# Altium project mat'_v4.PrjPcb
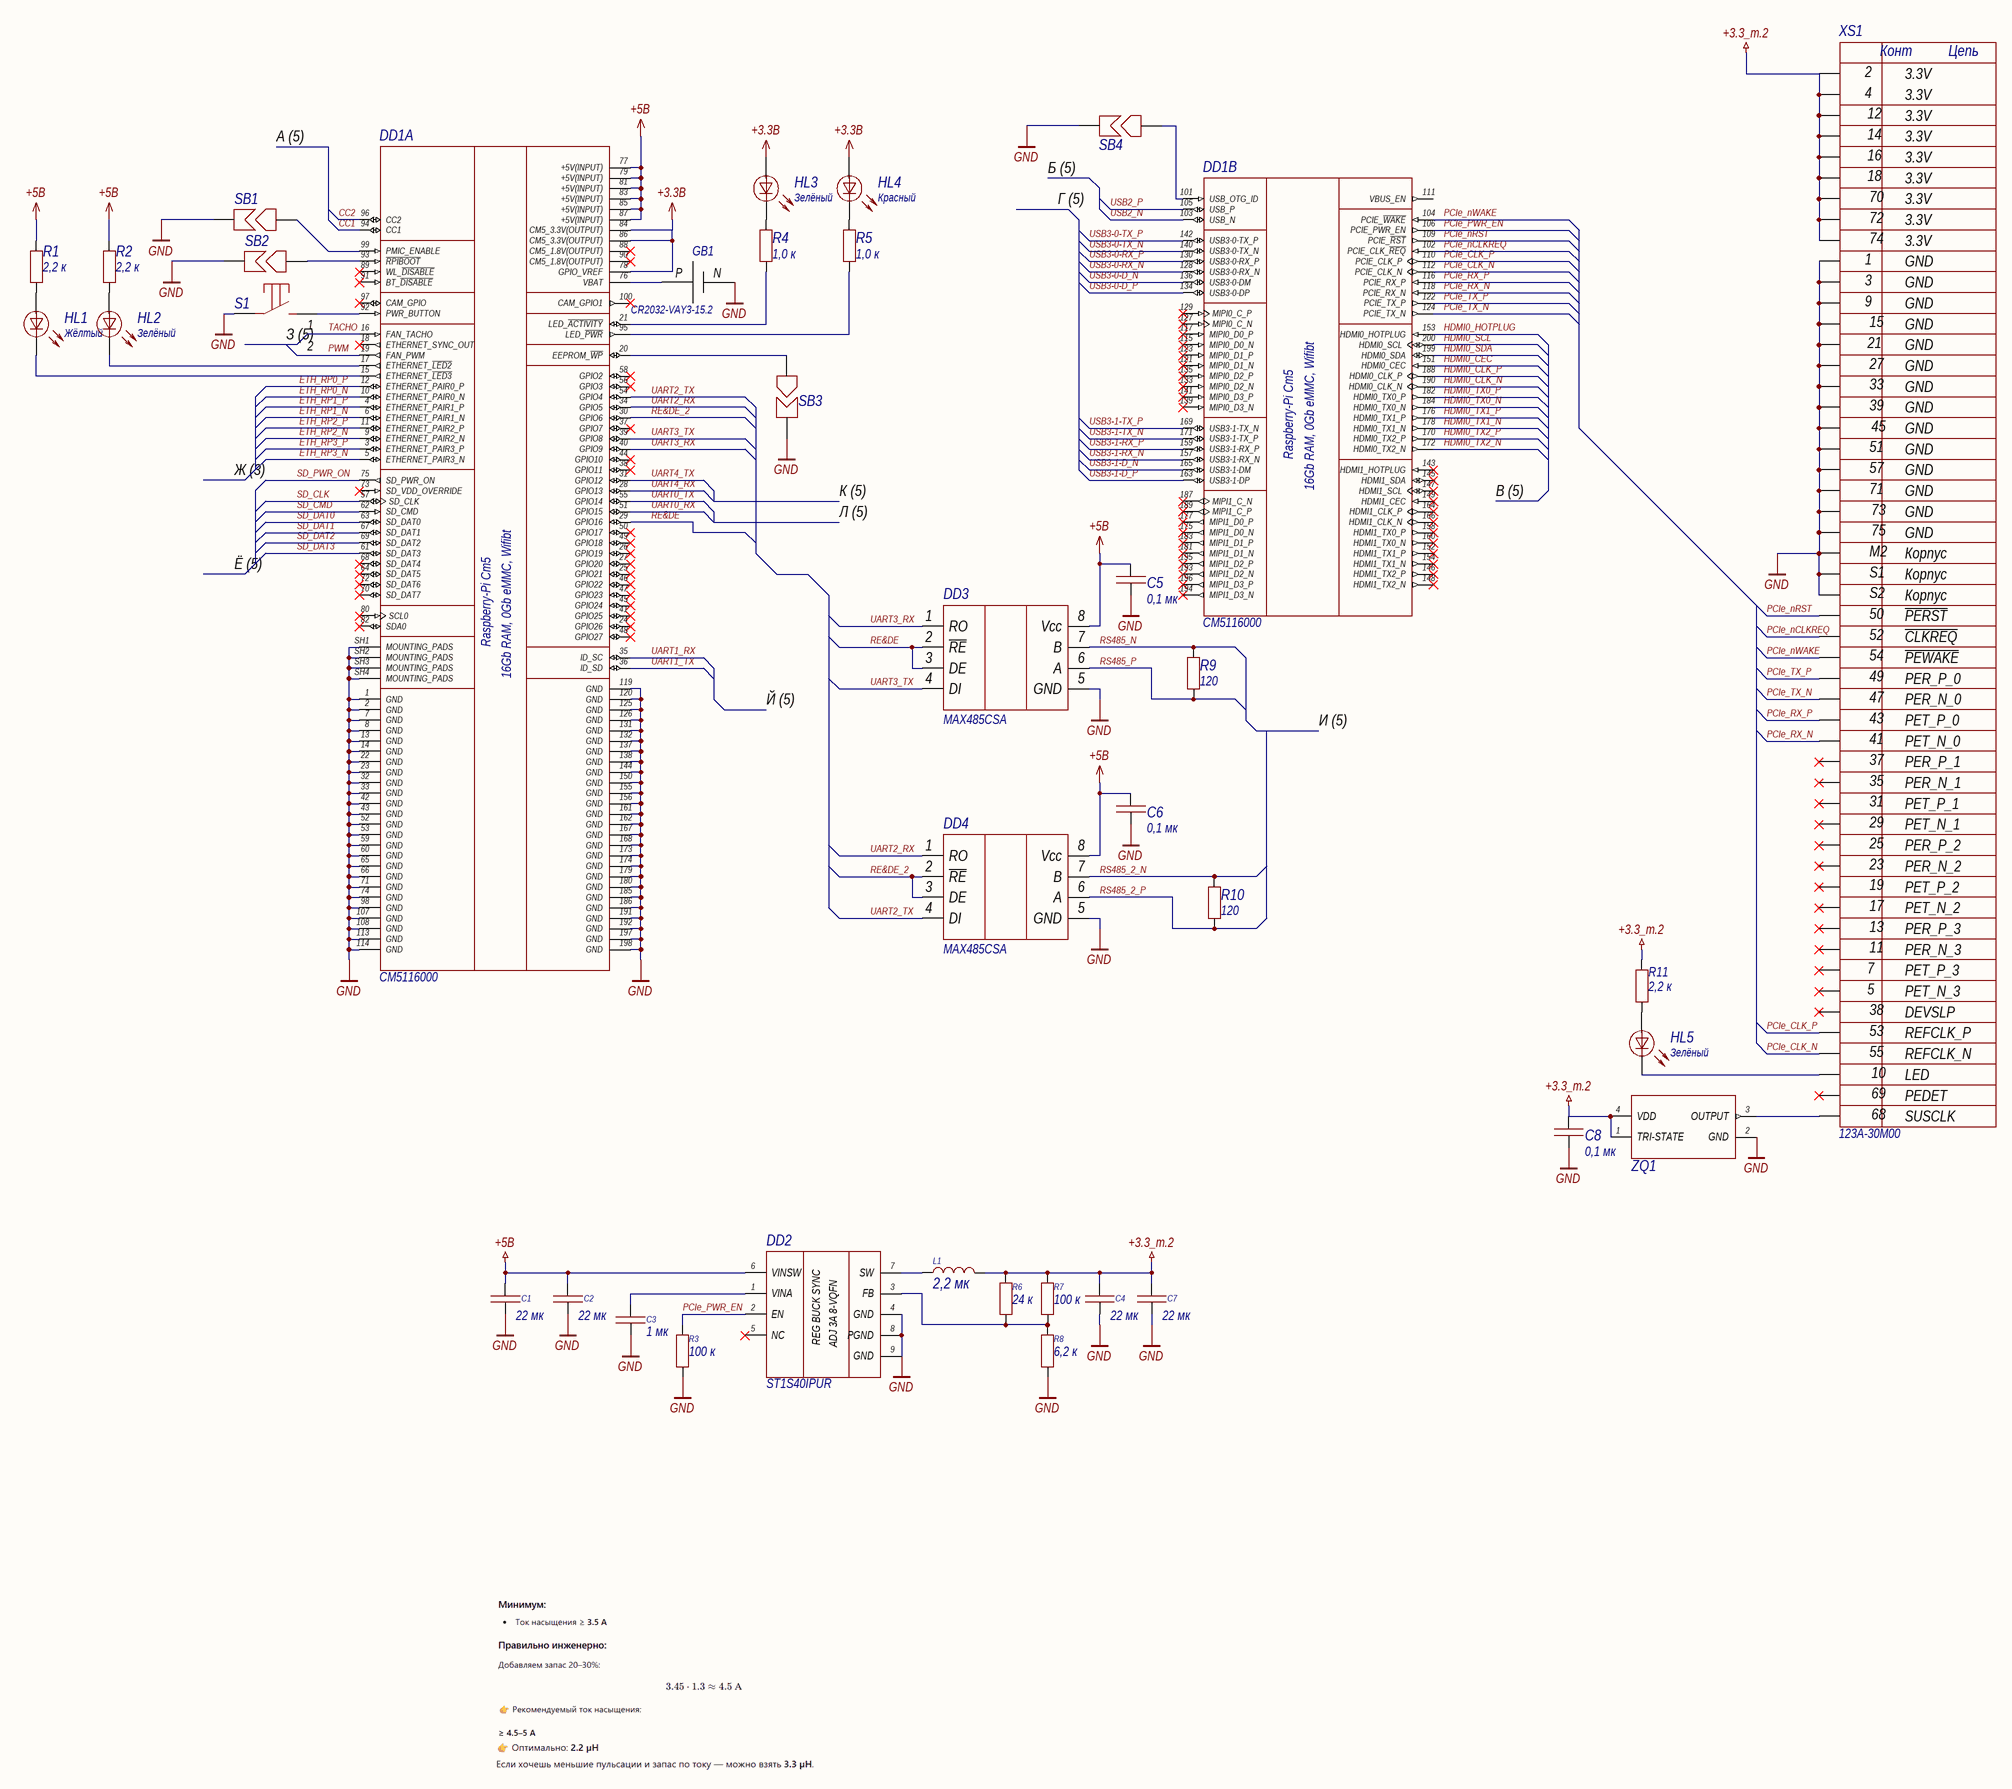
[diagram p0: cm5.SchDoc]
CheckedBy: Захаржевский С.; Decimal_Number_PCB: РТ2.11.03.03.26.08.81.15.002; Decimal_Number_Shematic: РТ2.11.03.03.26.08.81.15.001; DrawnBy: Карманов С.; Release_Date: 16.04.26; Title: Материнская плата аппарата NeoWelt v.2; Title1: Материнская плата; Title2: аппарата NeoWelt v.2; Version: 04
4 sheets, 146 parts. Net scope: global (net labels, ports and power ports of the same name join across sheets).
Board file: motherfucker_pcb.PcbDoc
Sheets:
  cm5.SchDoc
  dc-dc_eth+pump.SchDoc
  connectors.SchDoc
  DCDC_Jetson.SchDoc

## Sheet cm5.SchDoc: Материнская плата аппарата NeoWelt v.2
size 594 x 420 mm; Address1: Address1; Address2: Address2; Address3: Address3; Address4: Address4; DocumentNumber: 1; SheetNumber: 1; SheetTotal: 6; Перв_применение: РТ2.11.03.03.26.08.81.15.001 Э3

### Parts
C1  value 22 мк  [1210C]  (hidden comment: Capacitor)
C2  value 22 мк  [1210C]  (hidden comment: Capacitor)
C3  value 1 мк  [0603C]  (hidden comment: Capacitor)
C4  value 22 мк  [1210C]  (hidden comment: Capacitor)
C5  value 0,1 мк  [0603C]  (hidden comment: Capacitor)
C6  value 0,1 мк  [0603C]  (hidden comment: Capacitor)
C7  value 22 мк  [1210C]  (hidden comment: Capacitor)
C8  value 0,1 мк  [0603C]  (hidden comment: Capacitor)
DD1  CM5116000  [CM5116000]  (parts A,B of 2)
DD2  ST1S40IPUR  [VFQFPN8-4X4]
DD3  MAX485CSA  [SOIC-8]
DD4  MAX485CSA  [SOIC-8]
GB1  CR2032-VAY3-15.2  [CR2032-VAY3-15.2]
HL1  value Жёлтый  [0603D_yellow]  (hidden comment: LED 0603 YELLOW)
HL2  value Зелёный  [0603D_green]  (hidden comment: LED 0603 GREEN)
HL3  value Зелёный  [0603D_green]  (hidden comment: LED 0603 GREEN)
HL4  value Красный  [0603D_red]  (hidden comment: LED 0603 RED)
HL5  value Зелёный  [0603D_green]  (hidden comment: LED 0603 GREEN)
L1  value 2,2 мк  [IHLP-2020]  (hidden comment: IHLP2020BZER2R2M01)
R1  value 2,2 к  [0603R]  (hidden comment: Resistor)
R2  value 2,2 к  [0603R]  (hidden comment: Resistor)
R3  value 100 к  [0603R]  (hidden comment: Resistor)
R4  value 1,0 к  [0603R]  (hidden comment: Resistor)
R5  value 1,0 к  [0603R]  (hidden comment: Resistor)
R6  value 24 к  [0603R]  (hidden comment: Resistor)
R7  value 100 к  [0603R]  (hidden comment: Resistor)
R8  value 6,2 к  [0603R]  (hidden comment: Resistor)
R9  value 120  [1206R]  (hidden comment: Resistor)
R10  value 120  [1206R]  (hidden comment: Resistor)
R11  value 2,2 к  [0603R]  (hidden comment: Resistor)
S1  TSS-TD-19XA-XTR  [TSS-TD-19XA-XTR]  (value not drawn)
SB1  SB  [0603SB]  (value not drawn)  (net tie, no BOM)
SB2  SB  [0603SB]  (value not drawn)  (net tie, no BOM)
SB3  SB  [0603SB]  (value not drawn)  (net tie, no BOM)
SB4  SB  [0603SB]  (value not drawn)  (net tie, no BOM)
XS1  123A-30M00  [123A-30M00]
ZQ1  ASEK-32.768KHZ-LRT  [XTAL_ASEK-32.768KHZ-LRT]  (value not drawn)

### Nets
+3.3_m.2: C4.2 C7.2 C8.2 L1.2 R6.2 R7.2 R11.2 XS1.2(3.3V) XS1.4(3.3V) XS1.12(3.3V) XS1.14(3.3V) XS1.16(3.3V) XS1.18(3.3V) XS1.70(3.3V) XS1.72(3.3V) XS1.74(3.3V) ZQ1.1(TRI-STATE) ZQ1.4(VDD)
+3.3В: DD1.78(GPIO_VREF) DD1.84(CM5_3.3V(OUTPUT)) DD1.86(CM5_3.3V(OUTPUT)) HL3.1 HL4.1
+5В: C1.2 C2.2 C5.2 C6.2 DD1.77(+5V(INPUT)) DD1.79(+5V(INPUT)) DD1.81(+5V(INPUT)) DD1.83(+5V(INPUT)) DD1.85(+5V(INPUT)) DD1.87(+5V(INPUT)) DD2.6(VINSW) DD3.8(Vcc) DD4.8(Vcc) R1.2 R2.2
GND: C1.1 C2.1 C3.1 C4.1 C5.1 C6.1 C7.1 C8.1 DD1.1(GND) DD1.2(GND) DD1.7(GND) DD1.8(GND) DD1.13(GND) DD1.14(GND) DD1.22(GND) DD1.23(GND) DD1.32(GND) DD1.33(GND) DD1.42(GND) DD1.43(GND) DD1.52(GND) DD1.53(GND) DD1.59(GND) DD1.60(GND) DD1.65(GND) DD1.66(GND) DD1.71(GND) DD1.74(GND) DD1.98(GND) DD1.107(GND) DD1.108(GND) DD1.113(GND) DD1.114(GND) DD1.119(GND) DD1.120(GND) DD1.125(GND) DD1.126(GND) DD1.131(GND) DD1.132(GND) DD1.137(GND) DD1.138(GND) DD1.144(GND) DD1.150(GND) DD1.155(GND) DD1.156(GND) DD1.161(GND) DD1.162(GND) DD1.167(GND) DD1.168(GND) DD1.173(GND) DD1.174(GND) DD1.179(GND) DD1.180(GND) DD1.185(GND) DD1.186(GND) DD1.191(GND) DD1.192(GND) DD1.197(GND) DD1.198(GND) DD1.SH1(MOUNTING_PADS) DD1.SH2(MOUNTING_PADS) DD1.SH3(MOUNTING_PADS) DD1.SH4(MOUNTING_PADS) DD2.4(GND) DD2.8(PGND) DD2.9(GND) DD3.5(GND) DD4.5(GND) GB1.N R3.1 R8.1 S1.1 SB1.2 SB2.2 SB3.2 SB4.2 XS1.1(GND) XS1.3(GND) XS1.9(GND) XS1.15(GND) XS1.21(GND) XS1.27(GND) XS1.33(GND) XS1.39(GND) XS1.45(GND) XS1.51(GND) XS1.57(GND) XS1.71(GND) XS1.73(GND) XS1.75(GND) XS1.M2(Корпус) XS1.S1(Корпус) XS1.S2(Корпус) ZQ1.2(GND)
CC1: DD1.94(CC1)
CC2: DD1.96(CC2)
ETH_RP0_N: DD1.10(ETHERNET_PAIR0_N)
ETH_RP0_P: DD1.12(ETHERNET_PAIR0_P)
ETH_RP1_N: DD1.6(ETHERNET_PAIR1_N)
ETH_RP1_P: DD1.4(ETHERNET_PAIR1_P)
ETH_RP2_N: DD1.9(ETHERNET_PAIR2_N)
ETH_RP2_P: DD1.11(ETHERNET_PAIR2_P)
ETH_RP3_N: DD1.5(ETHERNET_PAIR3_N)
ETH_RP3_P: DD1.3(ETHERNET_PAIR3_P)
HDMI0_CEC: DD1.151(HDMI0_CEC)
HDMI0_CLK_N: DD1.190(HDMI0_CLK_N)
HDMI0_CLK_P: DD1.188(HDMI0_CLK_P)
HDMI0_HOTPLUG: DD1.153(HDMI0_HOTPLUG)
HDMI0_SCL: DD1.200(HDMI0_SCL)
HDMI0_SDA: DD1.199(HDMI0_SDA)
HDMI0_TX0_N: DD1.184(HDMI0_TX0_N)
HDMI0_TX0_P: DD1.182(HDMI0_TX0_P)
HDMI0_TX1_N: DD1.178(HDMI0_TX1_N)
HDMI0_TX1_P: DD1.176(HDMI0_TX1_P)
HDMI0_TX2_N: DD1.172(HDMI0_TX2_N)
HDMI0_TX2_P: DD1.170(HDMI0_TX2_P)
PCIe_CLK_N: DD1.112(PCIE_CLK_N) XS1.55(REFCLK_N)
PCIe_CLK_P: DD1.110(PCIE_CLK_P) XS1.53(REFCLK_P)
PCIe_nCLKREQ: DD1.102(PCIE_CLK_~{REQ}) XS1.52(~{CLKREQ})
PCIe_nRST: DD1.109(PCIE_~{RST}) XS1.50(~{PERST})
PCIe_nWAKE: DD1.104(PCIE_~{WAKE}) XS1.54(~{PEWAKE})
PCIe_PWR_EN: DD1.106(PCIE_PWR_EN) DD2.2(EN) R3.2
PCIe_RX_N: DD1.118(PCIE_RX_N) XS1.41(PET_N_0)
PCIe_RX_P: DD1.116(PCIE_RX_P) XS1.43(PET_P_0)
PCIe_TX_N: DD1.124(PCIE_TX_N) XS1.47(PER_N_0)
PCIe_TX_P: DD1.122(PCIE_TX_P) XS1.49(PER_P_0)
PWM: DD1.19(FAN_PWM)
RE&DE: DD1.29(GPIO16) DD3.2(~{RE}) DD3.3(DE)
RE&DE_2: DD1.30(GPIO6) DD4.2(~{RE}) DD4.3(DE)
RS485_2_N: DD4.7(B) R10.2
RS485_2_P: DD4.6(A) R10.1
RS485_N: DD3.7(B) R9.2
RS485_P: DD3.6(A) R9.1
SD_CLK: DD1.57(SD_CLK)
SD_CMD: DD1.62(SD_CMD)
SD_DAT0: DD1.63(SD_DAT0)
SD_DAT1: DD1.67(SD_DAT1)
SD_DAT2: DD1.69(SD_DAT2)
SD_DAT3: DD1.61(SD_DAT3)
SD_PWR_ON: DD1.75(SD_PWR_ON)
TACHO: DD1.16(FAN_TACHO)
UART0_RX: DD1.51(GPIO15)
UART0_TX: DD1.55(GPIO14)
UART1_RX: DD1.35(ID_SC)
UART1_TX: DD1.36(ID_SD)
UART2_RX: DD1.34(GPIO5) DD4.1(RO)
UART2_TX: DD1.54(GPIO4) DD4.4(DI)
UART3_RX: DD1.40(GPIO9) DD3.1(RO)
UART3_TX: DD1.39(GPIO8) DD3.4(DI)
UART4_RX: DD1.28(GPIO13)
UART4_TX: DD1.31(GPIO12)
USB2_N: DD1.103(USB_N)
USB2_P: DD1.105(USB_P)
USB3-0-D_N: DD1.136(USB3-0-DM)
USB3-0-D_P: DD1.134(USB3-0-DP)
USB3-0-RX_N: DD1.128(USB3-0-RX_N)
USB3-0-RX_P: DD1.130(USB3-0-RX_P)
USB3-0-TX_N: DD1.140(USB3-0-TX_N)
USB3-0-TX_P: DD1.142(USB3-0-TX_P)
USB3-1-D_N: DD1.165(USB3-1-DM)
USB3-1-D_P: DD1.163(USB3-1-DP)
USB3-1-RX_N: DD1.157(USB3-1-RX_N)
USB3-1-RX_P: DD1.159(USB3-1-RX_P)
USB3-1-TX_N: DD1.171(USB3-1-TX_P)
USB3-1-TX_P: DD1.169(USB3-1-TX_N)
NetC3_2: C3.2 DD2.1(VINA)
NetDD1_15: DD1.15(ETHERNET_~{LED3}) HL1.2
NetDD1_17: DD1.17(ETHERNET_~{LED2}) HL2.2
NetDD1_20: DD1.20(EEPROM_~{WP}) SB3.1
NetDD1_21: DD1.21(LED_~{ACTIVITY}) R4.2
NetDD1_76: DD1.76(VBAT) GB1.P
NetDD1_92: DD1.92(PWR_BUTTON) S1.2
NetDD1_93: DD1.93(~{RPIBOOT}) SB2.1
NetDD1_95: DD1.95(LED_~{PWR}) R5.2
NetDD1_99: DD1.99(PMIC_ENABLE) SB1.1
NetDD1_101: DD1.101(USB_OTG_ID) SB4.1
NetDD2_3: DD2.3(FB) R6.1 R7.1 R8.2
NetDD2_7: DD2.7(SW) L1.1
NetHL1_1: HL1.1 R1.1
NetHL2_1: HL2.1 R2.1
NetHL3_2: HL3.2 R4.1
NetHL4_2: HL4.2 R5.1
NetHL5_1: HL5.1 R11.1
NetHL5_2: HL5.2 XS1.10(LED)
NetXS1_68: XS1.68(SUSCLK) ZQ1.3(OUTPUT)

Not connected (* = marked no-connect by the designer): DD1 18(ETHERNET_SYNC_OUT)* 24(GPIO26)* 25(GPIO21)* 26(GPIO19)* 27(GPIO20)* 37(GPIO7)* 38(GPIO11)* 41(GPIO25)* 44(GPIO10)* 45(GPIO24)* 46(GPIO22)* 47(GPIO23)* 48(GPIO27)* 49(GPIO18)* 50(GPIO17)* 56(GPIO3)* 58(GPIO2)* 64(SD_DAT5)* 68(SD_DAT4)* 70(SD_DAT7)* 72(SD_DAT6)* 73(SD_VDD_OVERRIDE)* 80(SCL0)* 82(SDA0)* 88(CM5_1.8V(OUTPUT))* 89(WL_~{DISABLE})* 90(CM5_1.8V(OUTPUT))* 91(BT_~{DISABLE})* 97(CAM_GPIO)* 100(CAM_GPIO1)* 111(VBUS_EN) 115(MIPI0_D0_N)* 117(MIPI0_D0_P)* 121(MIPI0_D1_N)* 123(MIPI0_D1_P)* 127(MIPI0_C_N)* 129(MIPI0_C_P)* 133(MIPI0_D2_N)* 135(MIPI0_D2_P)* 139(MIPI0_D3_N)* 141(MIPI0_D3_P)* 143(HDMI1_HOTPLUG)* 145(HDMI1_SDA)* 146(HDMI1_TX2_P)* 147(HDMI1_SCL)* 148(HDMI1_TX2_N)* 149(HDMI1_CEC)* 152(HDMI1_TX1_P)* 154(HDMI1_TX1_N)* 158(HDMI1_TX0_P)* 160(HDMI1_TX0_N)* 164(HDMI1_CLK_P)* 166(HDMI1_CLK_N)* 175(MIPI1_D0_N)* 177(MIPI1_D0_P)* 181(MIPI1_D1_N)* 183(MIPI1_D1_P)* 187(MIPI1_C_N)* 189(MIPI1_C_P)* 193(MIPI1_D2_N)* 194(MIPI1_D3_N)* 195(MIPI1_D2_P)* 196(MIPI1_D3_P)*; DD2 5(NC)*; XS1 5(PET_N_3)* 7(PET_P_3)* 11(PER_N_3)* 13(PER_P_3)* 17(PET_N_2)* 19(PET_P_2)* 23(PER_N_2)* 25(PER_P_2)* 29(PET_N_1)* 31(PET_P_1)* 35(PER_N_1)* 37(PER_P_1)* 38(DEVSLP)* 69(PEDET)*

### Notes on the sheet
- А (5)
- (near SB4) Б (5)
- Г (5)
- (near S1) З (5)
- (near S1) 1
- (near S1) 2
- Ж (3)
- К (5)
- Л (5)
- В (5)
- Ё (5)
- Й (5)
- И (5)
- Перв. примен.
- Справ. №
- Подп. и дата
- Инв. № дубл.
- Взам. инв. №
- Разраб.
- Изм.
- Лист
- № докум.
- Подп.
- Дата
- Лит.
- Масса
- Масштаб
- Пров.
- Т.контр.
- Схема электрическая принципиальная
- Листов
- Инв. № подл.
- Утв.
- Н.контр.
- Копировал
- Формат А2
- МГТУ им. Н. Э. Баумана
  Кафедра ИУ4
  Группа РТ2-81Б
- (in symbol 123A-30M00) Конт; Цепь
- (in symbol CM5116000, part A) Raspberry-Pi Cm5; 16Gb RAM, 0Gb eMMC, Wifibt
- (in symbol CM5116000, part B) Raspberry-Pi Cm5; 16Gb RAM, 0Gb eMMC, Wifibt
- (in symbol ST1S40IPUR) REG BUCK SYNC; ADJ 3A 8-VQFN

### Library data of the parts
C1 C2 C4 C7 = Capacitor_22u_10_25V_X7R_1210C: Конденсатор 1210C ёмкостью 22 мк 10%, 25 В, X7R; Voltage (V): 25; Capacity (nF): 22000; Part Number: Capacitor_22u_10_25V_X7R_1210C; Tolerance: 10%; Dielectric: X7R
C3 = Capacitor_1u_10_50V_X7R_0603C: Конденсатор 0603C ёмкостью 1 мк 10%, 50 В, X7R; Voltage (V): 50; Capacity (nF): 1000; Part Number: Capacitor_1u_10_50V_X7R_0603C; Tolerance: 10%; Dielectric: X7R
C5 C6 C8 = Capacitor_0,1u_10_50V_X7R_0603C: Конденсатор 0603C ёмкостью 0,1 мк 10%, 50 В, X7R; Voltage (V): 50; Capacity (nF): 100; Part Number: Capacitor_0,1u_10_50V_X7R_0603C; Tolerance: 10%; Dielectric: X7R
DD1 = CM5116000: Raspberry-Pi Cm5 16Gb RAM, 0Gb eMMC, Wifibt; MF: Raspberry Pi; MP: CM5108064B; Автор: rreali; SnapEDA_Link: https://www.snapeda.com/parts/CM5108064B/Raspberry+Pi/view-part/?ref=snap; Package: None; Value: *; Check_prices: https://www.snapeda.com/parts/CM5108064B/Raspberry+Pi/view-part/?ref=eda; Part Number: CM5116000; Datasheet: https://pip-assets.raspberrypi.com/categories/944-raspberry-pi-compute-module-5/documents/RP-008180-DS-6-cm5-datasheet.pdf?disposition=inline
DD2 = ST1S40IPUR: Преобразователь постоянного тока понижающий синхронный подстраиваемый 3А; MF: STMicroelectronics; Автор: rreali; SnapEDA_Link: https://www.snapeda.com/parts/ST1S40IPUR/STMicroelectronics/view-part/?ref=snap; Package: VDFN-8 STMicroelectronics; Value: *; MP: ST1S40IPUR; Check_prices: https://www.snapeda.com/parts/ST1S40IPUR/STMicroelectronics/view-part/?ref=eda; Part Number: ST1S40IPUR; Datasheet: https://cdn.promelec.ru/upload/datasheet/6/4/CD00284753.pdf
DD3 DD4 = MAX485CSA: RS-485 приёмопередатчик; Part Number: MAX485CSA
GB1 = CR2032-VAY3-15.2: Li, MnO2 батарея типоразмера R20, 3В, 0.22Ач, приваренные выводы, -20...60 °C; Автор: rreali; Part Number: CR2032-VAY3-15.2
HL1 = LED 0603 YELLOW: Светодиод 0603 Жёлтый; Автор: rreali; Part Number: LED 0603 YELLOW
HL2 HL3 HL5 = LED 0603 GREEN: Светодиод 0603 Зелёный; Автор: rreali; Part Number: LED 0603 GREEN
HL4 = LED 0603 RED: Светодиод 0603 Красный; Автор: rreali; Part Number: LED 0603 RED
L1 = IHLP2020BZER2R2M01: Катушка индуктивности SMD экранированная 2,2мкГн ±20% 4,2A 50,1мОм 2020 лента на катушке; Inductance (μH): 2,2; Current: 4,5 А; Автор: rreali; Part Number: IHLP2020BZER2R2M01; Datasheet: https://cdn.promelec.ru/upload/datasheet/0/8/ihlp-2020bz-01.pdf
R1 R2 R11 = Resistor_2.2k_1_0603: Резистор номиналом 2,2 кОм 1%; Power: *; Part Number: Resistor_2.2k_1_0603; Tolerance: 1%
R3 R7 = Resistor_100k_1_0603: Резистор номиналом 100 кОм 1%; Power: *; Part Number: Resistor_100k_1_0603; Tolerance: 1%
R4 R5 = Resistor_1.0k_1_0603: Резистор номиналом 1,0 кОм 1%; Power: *; Part Number: Resistor_1.0k_1_0603; Tolerance: 1%
R6 = Resistor_24k_1_0603: Резистор номиналом 24 кОм 1%; Power: *; Part Number: Resistor_24k_1_0603; Tolerance: 1%
R8 = Resistor_6.2k_1_0603: Резистор номиналом 6,2 кОм 1%; Power: *; Part Number: Resistor_6.2k_1_0603; Tolerance: 1%
R9 R10 = Resistor_120_1_0603: Резистор номиналом 120 Ом 1%; Power: *; Part Number: Resistor_120_1_0603; Tolerance: 1%
S1 = TSS-TD-19XA-XTR: Тактовая кнопка; Автор: glebmih; Part Number: TSS-TD-19XA-XTR; Datasheet: https://cdn.promelec.ru/upload/items/2023/04/17/TSS-TD-19XA.pdf
SB1-SB4 = SB: Solder bridge, мост припоя, запаиваемая перемычка, net tie, jumper; Автор: rreali; Part Number: SB
XS1 = 123A-30M00: Разъем: M.2 (NGFF); горизонтальный; SMT; gold flash; PIN: 67; 0,5А; System: Connector; Автор: rreali; Part Number: 123A-30M00; Datasheet: https://static.chipdip.ru/lib/882/DOC040882845.pdf
ZQ1 = ASEK-32.768KHZ-LRT: Генератор кварцевый керамика 32.768кГц ±25ppm/°С -40°C....+85В°C SMT; Автор: rreali; Value: 32.768кГц; Availability: Unavailable; Price: None; Package: None; MP: ASEK-32.768KHZ-LRT; Part Number: ASEK-32.768KHZ-LRT

## Sheet dc-dc_eth+pump.SchDoc: Материнская плата аппарата NeoWelt v.2
size 420 x 297 mm; Address1: Address1; Address2: Address2; Address3: Address3; Address4: Address4; DocumentNumber: 4; SheetNumber: 4; SheetTotal: 6; Перв_применение: РТ2.11.03.03.26.08.81.15.001 Э3
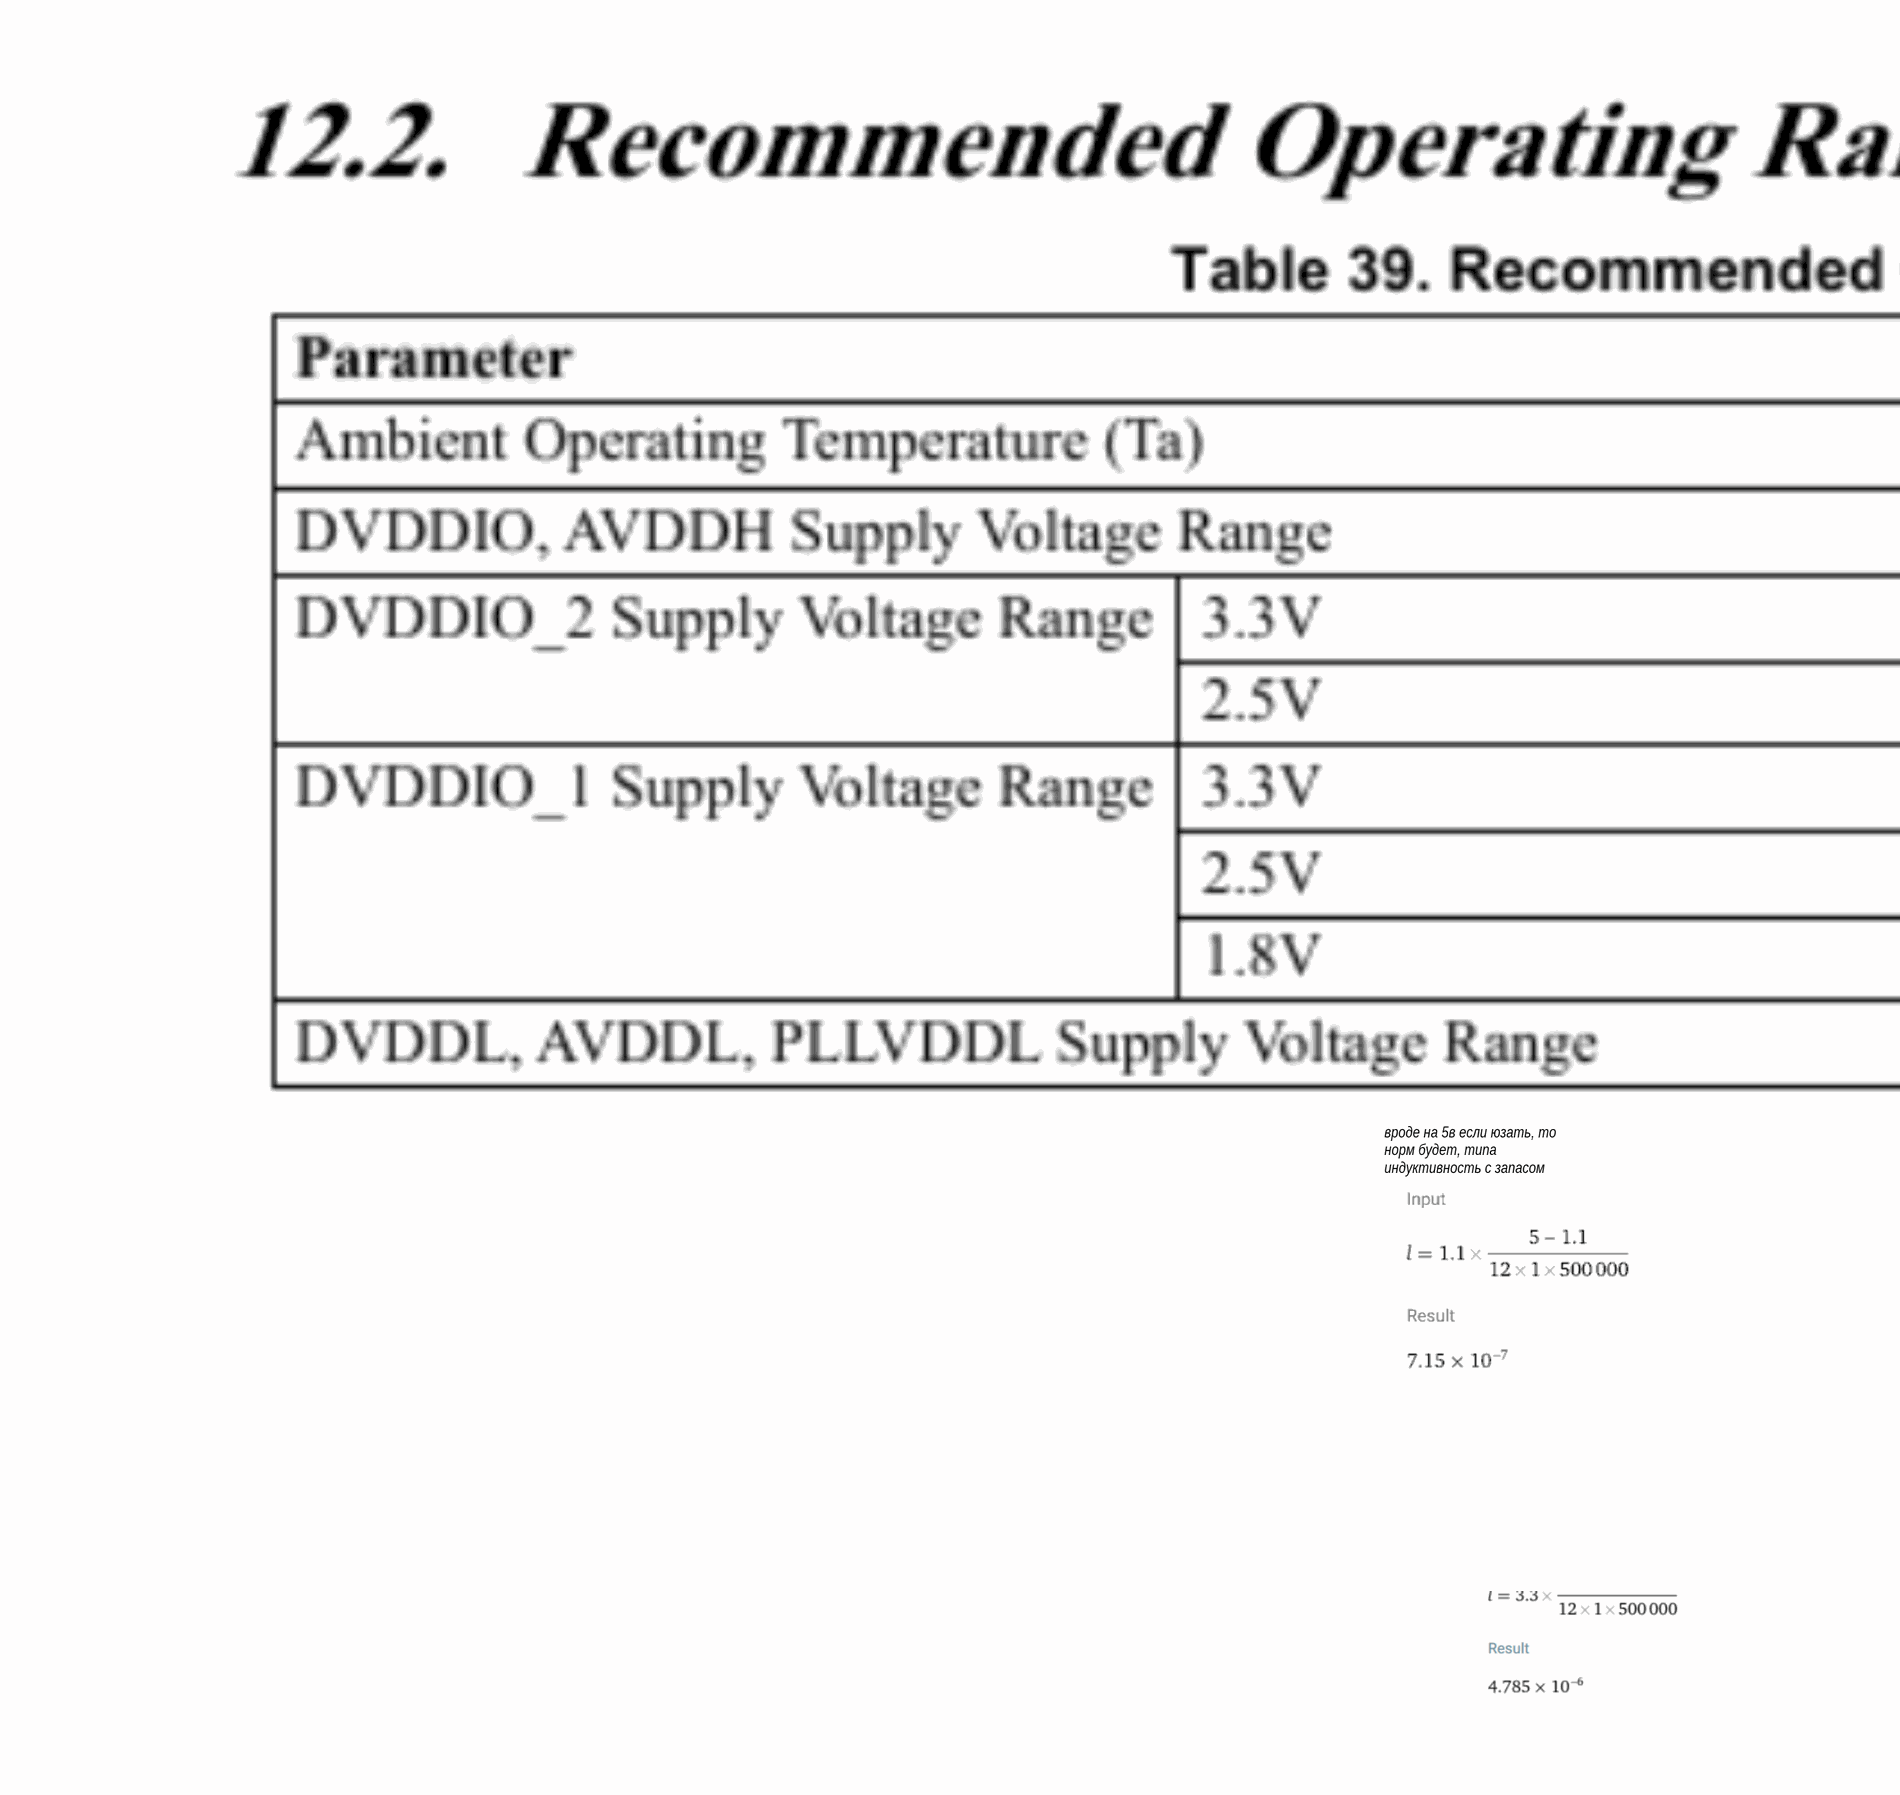
[diagram p1: dc-dc_eth+pump.SchDoc, top left]
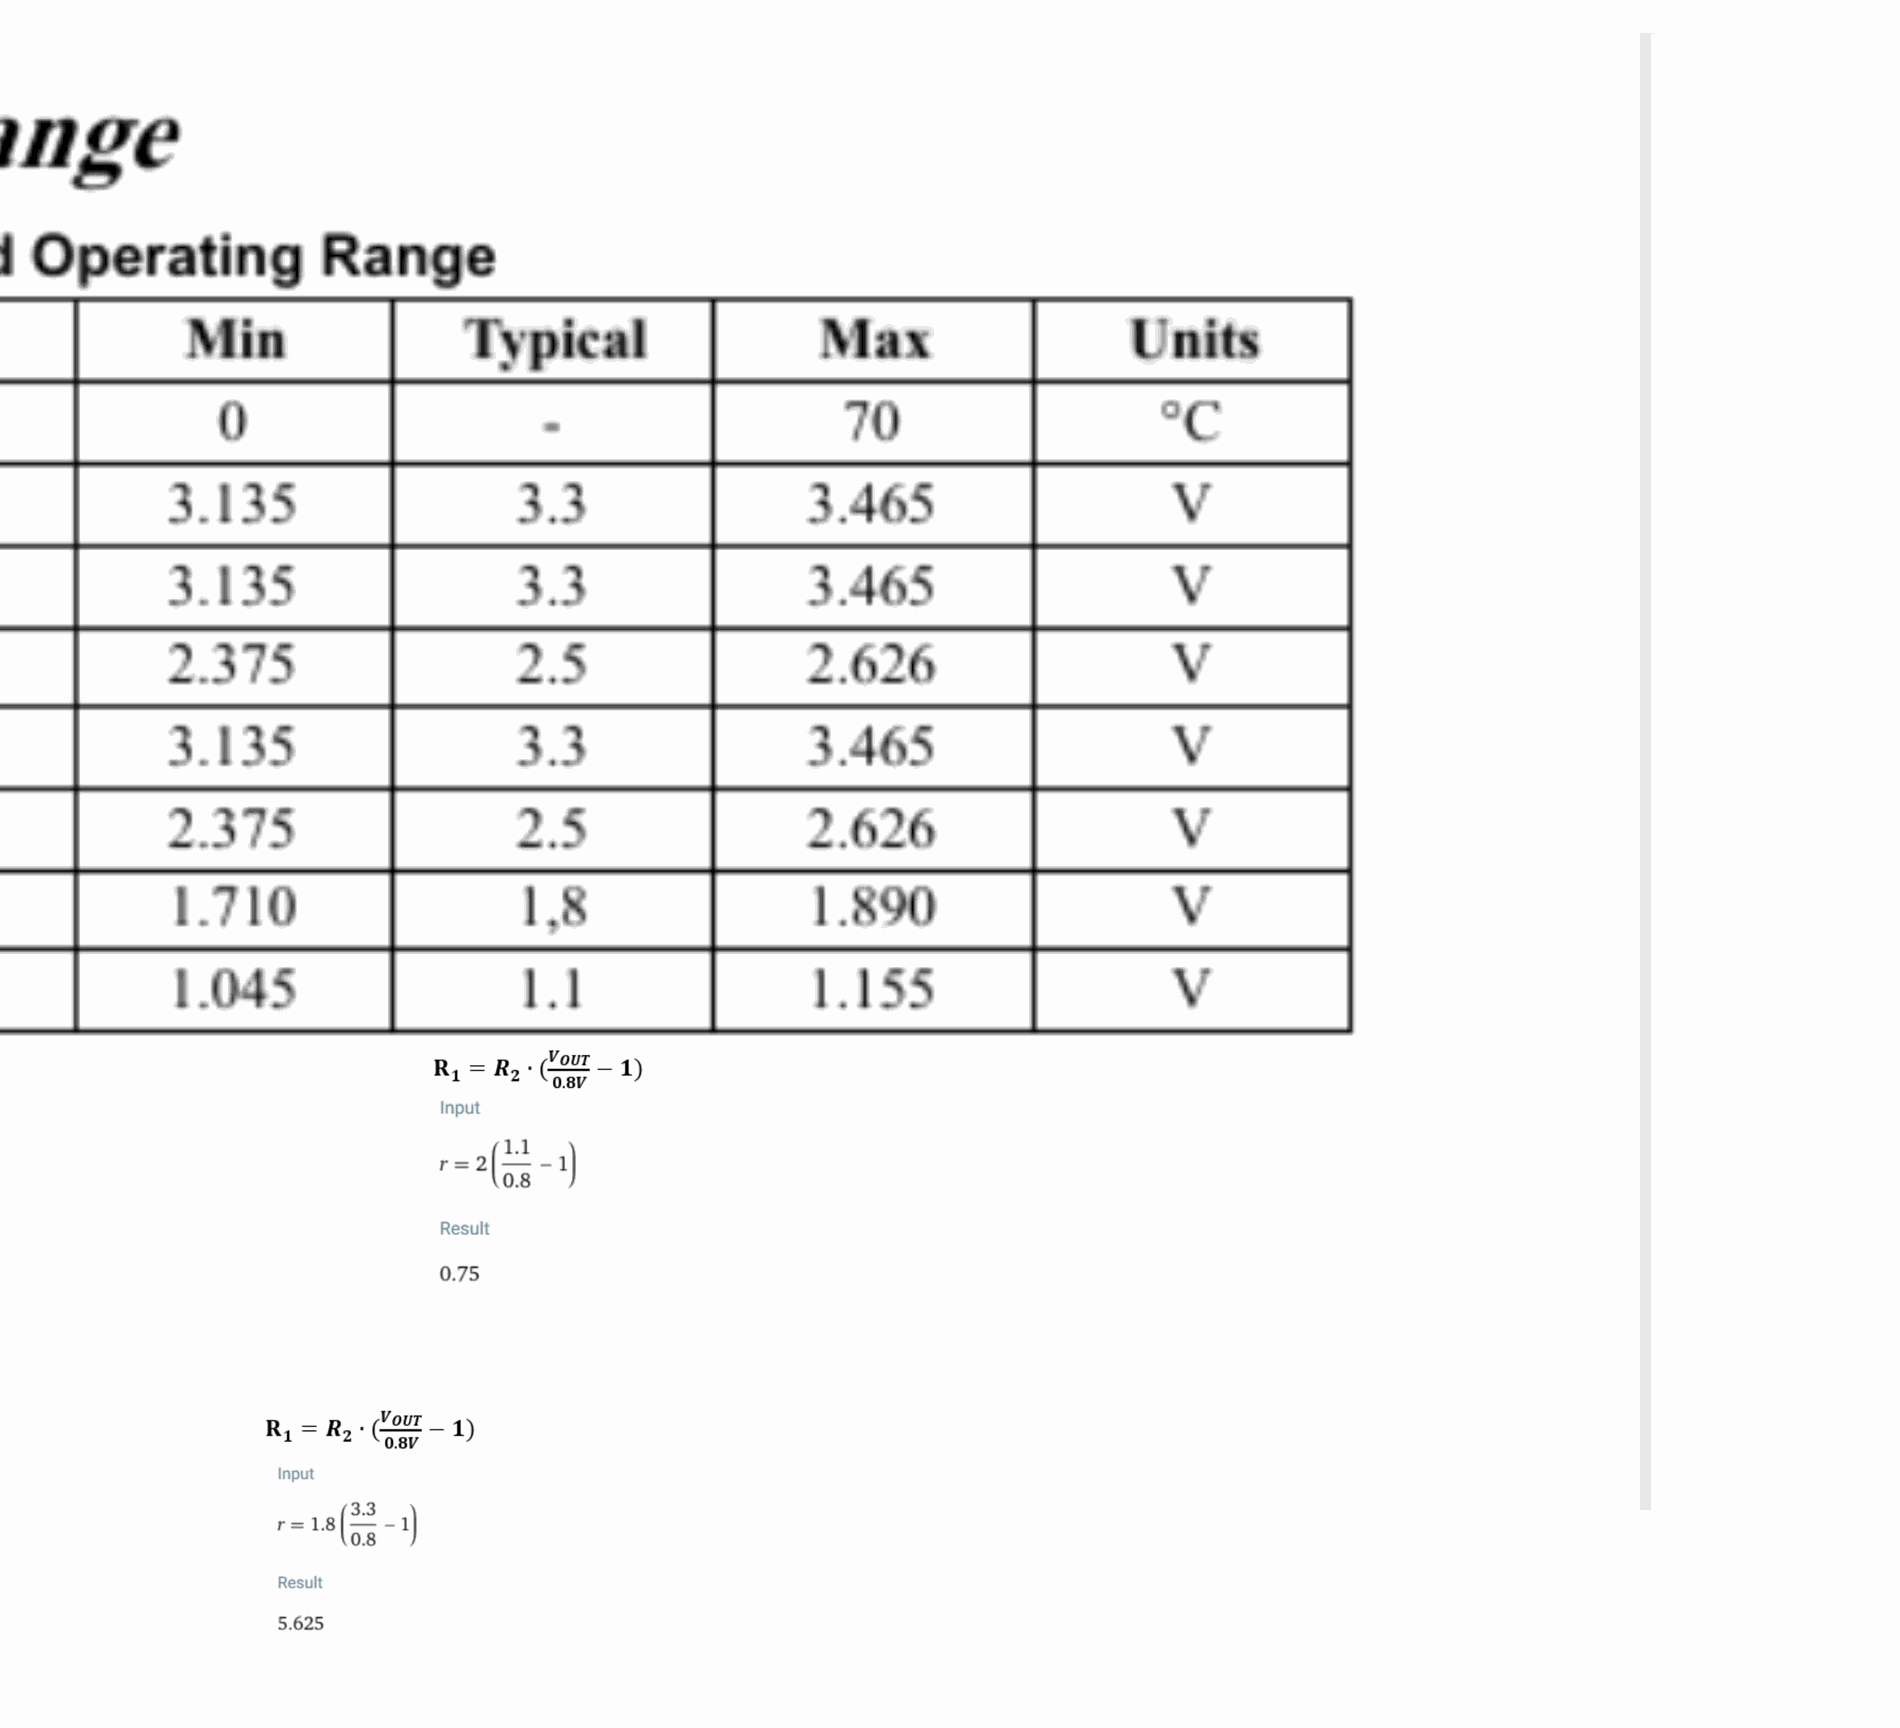
[diagram p2: dc-dc_eth+pump.SchDoc, top right]
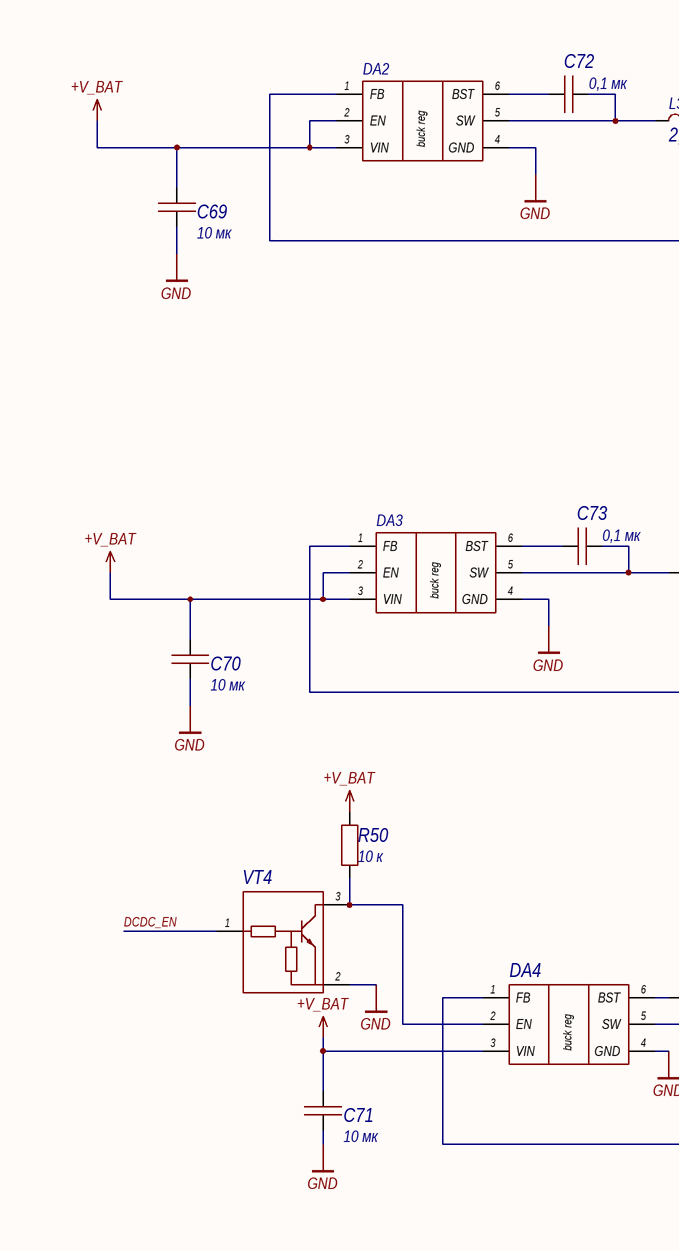
[diagram p3: dc-dc_eth+pump.SchDoc, bottom left]
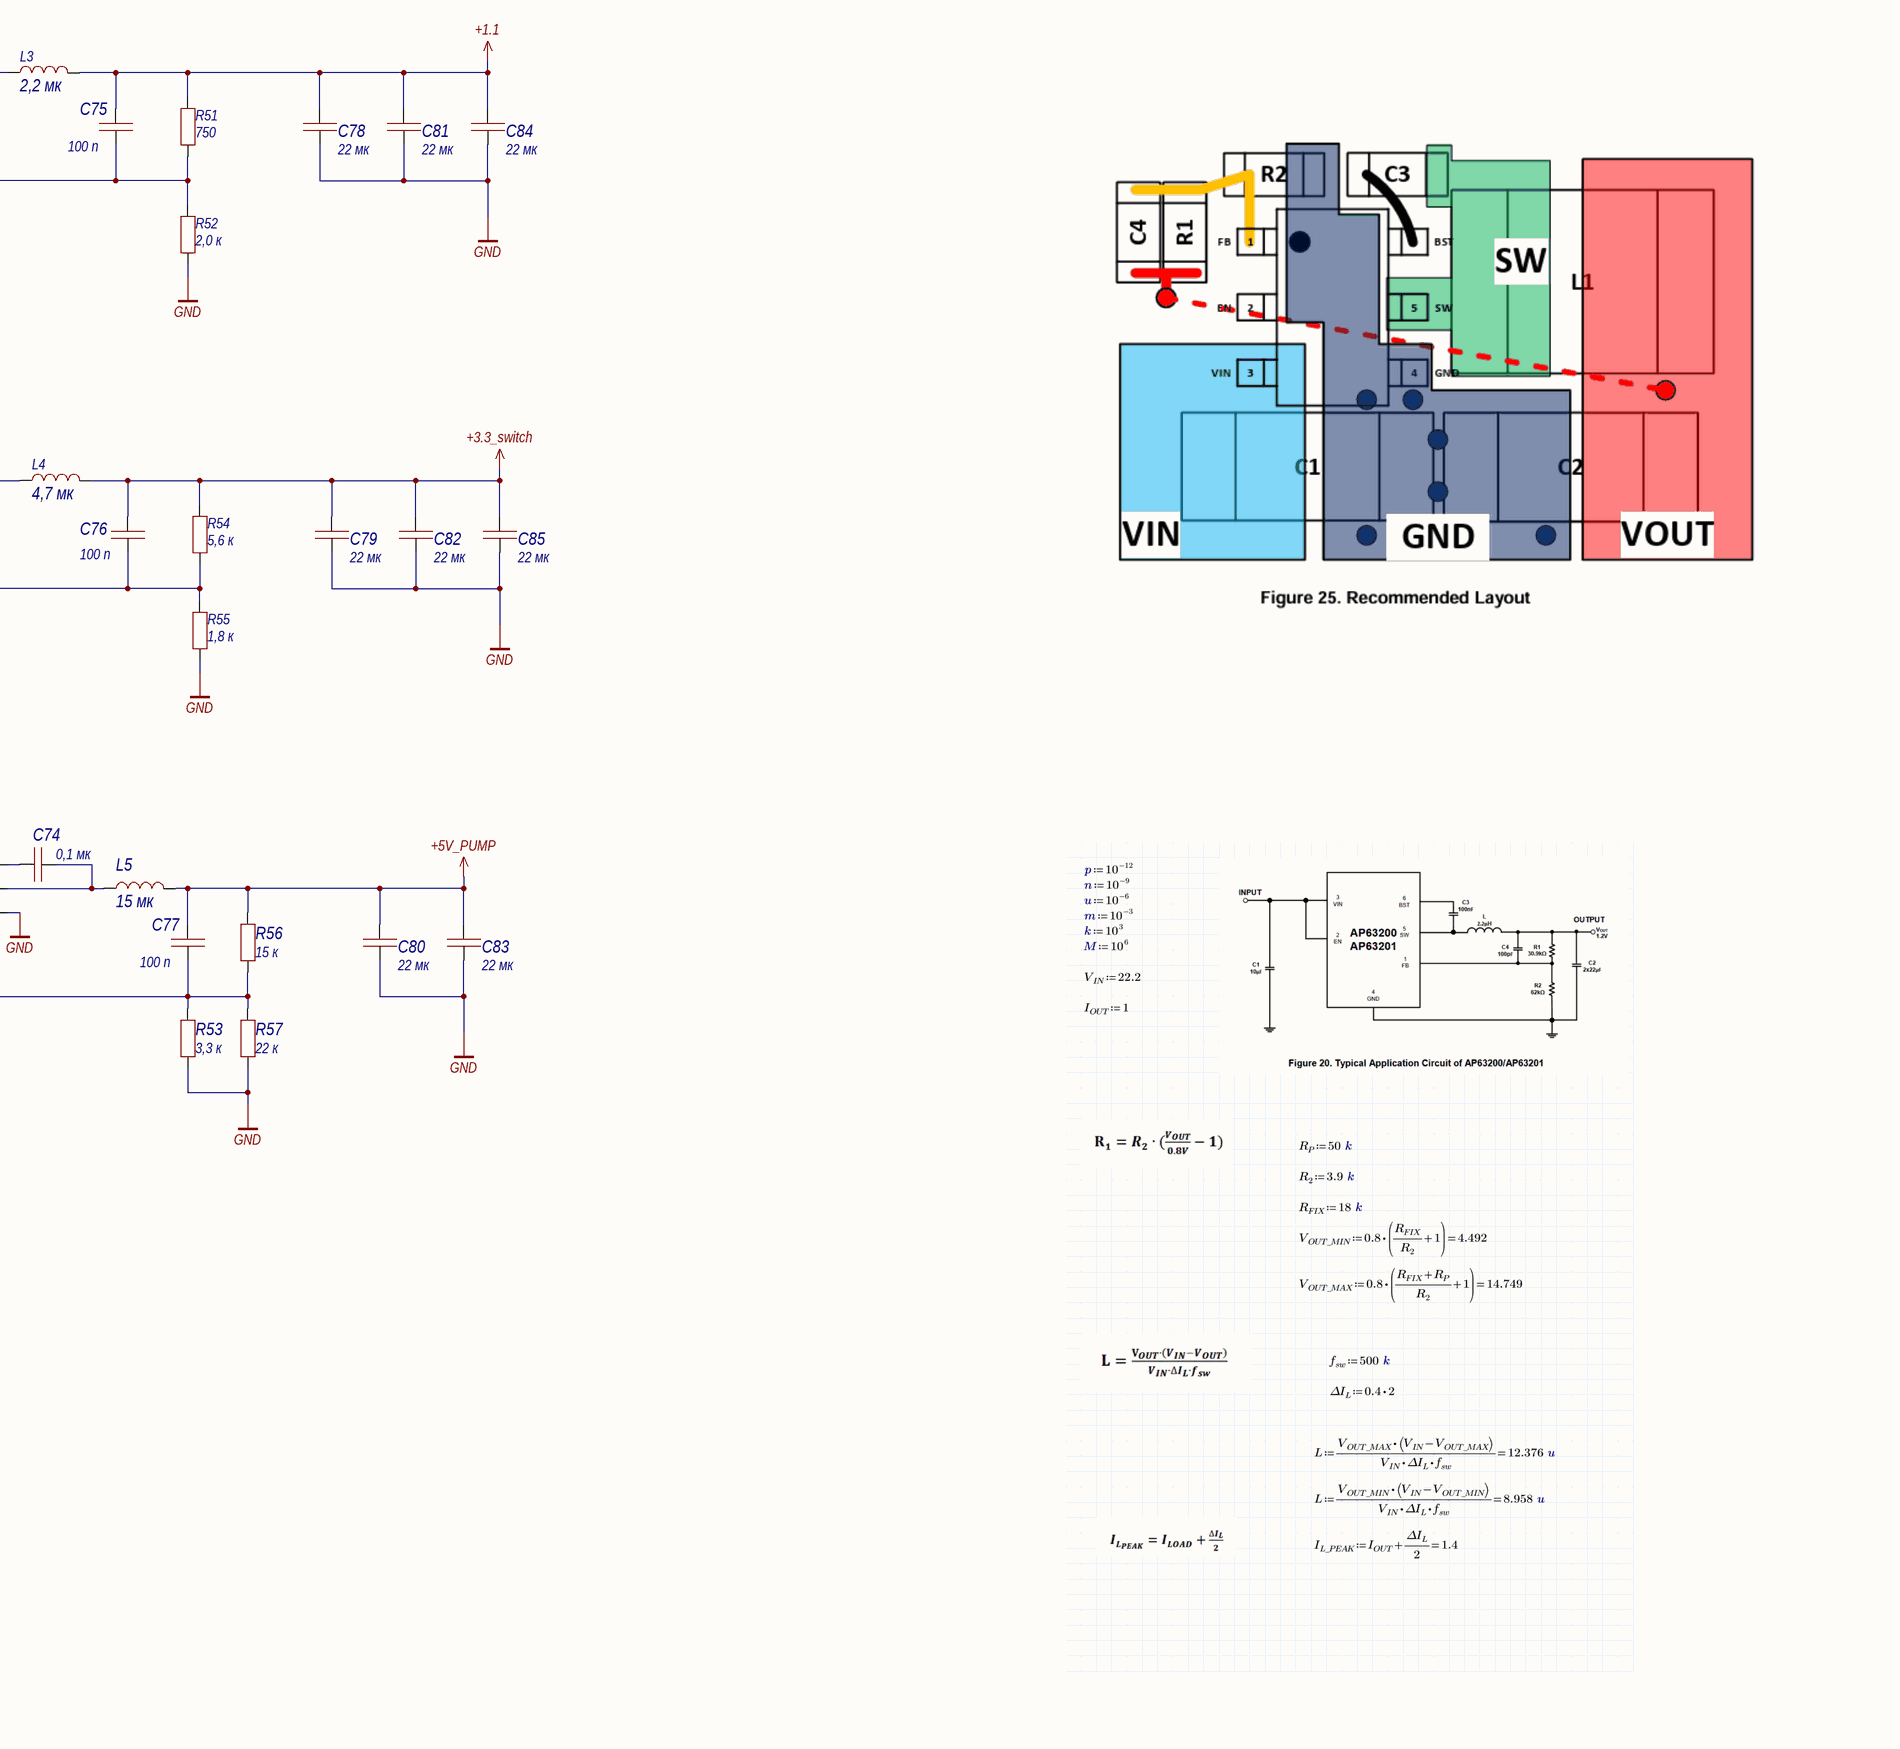
[diagram p4: dc-dc_eth+pump.SchDoc, bottom right]

### Parts
C69  value 10 мк  [1210C]  (hidden comment: Capacitor)
C70  value 10 мк  [1210C]  (hidden comment: Capacitor)
C71  value 10 мк  [1210C]  (hidden comment: Capacitor)
C72  value 0,1 мк  [0603C]  (hidden comment: Capacitor)
C73  value 0,1 мк  [0603C]  (hidden comment: Capacitor)
C74  value 0,1 мк  [0603C]  (hidden comment: Capacitor)
C75  value 100 п  [0603C]  (hidden comment: Capacitor)
C76  value 100 п  [0603C]  (hidden comment: Capacitor)
C77  value 100 п  [0603C]  (hidden comment: Capacitor)
C78  value 22 мк  [1210C]  (hidden comment: Capacitor)
C79  value 22 мк  [1210C]  (hidden comment: Capacitor)
C80  value 22 мк  [1210C]  (hidden comment: Capacitor)
C81  value 22 мк  [1210C]  (hidden comment: Capacitor)
C82  value 22 мк  [1210C]  (hidden comment: Capacitor)
C83  value 22 мк  [1210C]  (hidden comment: Capacitor)
C84  value 22 мк  [1210C]  (hidden comment: Capacitor)
C85  value 22 мк  [1210C]  (hidden comment: Capacitor)
DA2  AP63200  [TSOT26]  (value not drawn)
DA3  AP63200  [TSOT26]  (value not drawn)
DA4  AP63200  [TSOT26]  (value not drawn)
L3  value 2,2 мк  [CDRH6D12]  (hidden comment: CDRH6D12NP-2R2NC)
L4  value 4,7 мк  [B82462G4]  (hidden comment: B82472G6472M)
L5  value 15 мк  [SP43]  (hidden comment: SP43-150K)
R50  value 10 к  [0603R]  (hidden comment: Resistor)
R51  value 750  [0603R]  (hidden comment: Resistor)
R52  value 2,0 к  [0603R]  (hidden comment: Resistor)
R53  value 3,3 к  [0603R]  (hidden comment: Resistor)
R54  value 5,6 к  [0603R]  (hidden comment: Resistor)
R55  value 1,8 к  [0603R]  (hidden comment: Resistor)
R56  value 15 к  [0603R]  (hidden comment: Resistor)
R57  value 22 к  [0603R]  (hidden comment: Resistor)
VT4  PDTC114ET  [SOT23-3]  (value not drawn)

### Nets
+1.1: C75.2 C78.2 C81.2 C84.2 L3.3 R51.2
+3.3_switch: C76.2 C79.2 C82.2 C85.2 L4.2 R54.2
+5V_PUMP: C77.2 C80.2 C83.2 L5.2 R56.2
+V_BAT: C69.2 C70.2 C71.2 DA2.2(EN) DA2.3(VIN) DA3.2(EN) DA3.3(VIN) DA4.3(VIN) R50.2
GND: C69.1 C70.1 C71.1 C78.1 C79.1 C80.1 C81.1 C82.1 C83.1 C84.1 C85.1 DA2.4(GND) DA3.4(GND) DA4.4(GND) R52.1 R53.1 R55.1 R57.1 VT4.2(E)
DCDC_EN: VT4.1(B)
NetC72_1: C72.1 DA2.6(BST)
NetC72_2: C72.2 DA2.5(SW) L3.1
NetC73_1: C73.1 DA3.6(BST)
NetC73_2: C73.2 DA3.5(SW) L4.1
NetC74_1: C74.1 DA4.6(BST)
NetC74_2: C74.2 DA4.5(SW) L5.1
NetC75_1: C75.1 DA2.1(FB) R51.1 R52.2
NetC76_1: C76.1 DA3.1(FB) R54.1 R55.2
NetC77_1: C77.1 DA4.1(FB) R53.2 R56.1 R57.2
NetDA4_2: DA4.2(EN) R50.1 VT4.3(C)

### Notes on the sheet
- вроде на 5в если юзать, то норм будет, типа индуктивность с запасом
- Перв. примен.
- Справ. №
- Подп. и дата
- Инв. № дубл.
- Взам. инв. №
- Инв. № подл.
- Изм.
- Лист
- № докум.
- Подп.
- Дата
- Копировал
- Формат А3
- (in symbol AP63200) buck reg

### Library data of the parts
C69-C71 = Capacitor_10u_10_35V_X7R_1210C: Конденсатор 1210C ёмкостью 10 мк 10%, 35 В, X7R; Voltage (V): 35; Capacity (nF): 10000; Part Number: Capacitor_10u_10_35V_X7R_1210C; Tolerance: 10%; Dielectric: X7R
C72-C74 = Capacitor_0,1u_10_50V_X7R_0603C: as C5 on sheet cm5; Part Number: Capacitor_0,1u_10_50V_X7R_0603C; Tolerance: 10%; Dielectric: X7R
C75-C77 = Capacitor_100p_10_50V_X7R_0603C: Конденсатор 0603C ёмкостью 100 п 10%, 50 В, X7R; Voltage (V): 50; Capacity (nF): 0,1; Part Number: Capacitor_100p_10_50V_X7R_0603C; Tolerance: 10%; Dielectric: X7R
C78-C85 = Capacitor_22u_10_25V_X7R_1210C: as C1 on sheet cm5; Part Number: Capacitor_22u_10_25V_X7R_1210C; Tolerance: 10%; Dielectric: X7R
DA2-DA4 = AP63200: DC-DC понижающий преобразователь, Vin: 3.8 - 40 В, adj, 2 А; Part Number: AP63200
L3 = CDRH6D12NP-2R2NC: Индуктивность на 2,2 мкГн, номинальный ток 2,5 А; Inductance (μH): 2,2; Current: 2,5 А; Автор: rreali; Part Number: CDRH6D12NP-2R2NC
L4 = B82472G6472M: Индуктивность на 4,7 мкГн, номинальный ток 2,5 А; Inductance (μH): 4,7; Current: 2,5 А; Автор: rreali; Part Number: B82472G6472M
L5 = SP43-150K: Индуктивность на 15 мкГн, номинальный ток 1,3 А; Inductance (μH): 15; Current: 1,3 А; Part Number: SP43-150K
R50 = Resistor_10k_1_0603: Резистор номиналом 10 кОм 1%; Power: *; Part Number: Resistor_10k_1_0603; Tolerance: 1%
R51 = Resistor_750_1_0603: Резистор номиналом 750 Ом 1%; Power: *; Part Number: Resistor_750_1_0603; Tolerance: 1%
R52 = Resistor_2.0k_1_0603: Резистор номиналом 2,0 кОм 1%; Power: *; Part Number: Resistor_2.0k_1_0603; Tolerance: 1%
R53 = Resistor_3.3k_1_0603: Резистор номиналом 3,3 кОм 1%; Power: *; Part Number: Resistor_3.3k_1_0603; Tolerance: 1%
R54 = Resistor_5.6k_1_0603: Резистор номиналом 5,6 кОм 1%; Power: *; Part Number: Resistor_5.6k_1_0603; Tolerance: 1%
R55 = Resistor_1.8k_1_0603: Резистор номиналом 1,8 кОм 1%; Power: *; Part Number: Resistor_1.8k_1_0603; Tolerance: 1%
R56 = Resistor_15k_1_0603: Резистор номиналом 15 кОм 1%; Power: *; Part Number: Resistor_15k_1_0603; Tolerance: 1%
R57 = Resistor_22k_1_0603: Резистор номиналом 22 кОм 1%; Power: *; Part Number: Resistor_22k_1_0603; Tolerance: 1%
VT4 = PDTC114ET: цифровой npn 50в 100мА; Current (A): 0, 1 А; Part Number: PDTC114ET; Voltage (V): 50 В

## Sheet connectors.SchDoc: Материнская плата аппарата NeoWelt v.2
size 594 x 420 mm; Address1: Address1; Address2: Address2; Address3: Address3; Address4: Address4; DocumentNumber: 5; SheetNumber: 5; SheetTotal: 6; Перв_применение: РТ2.11.03.03.26.08.81.15.001 Э3
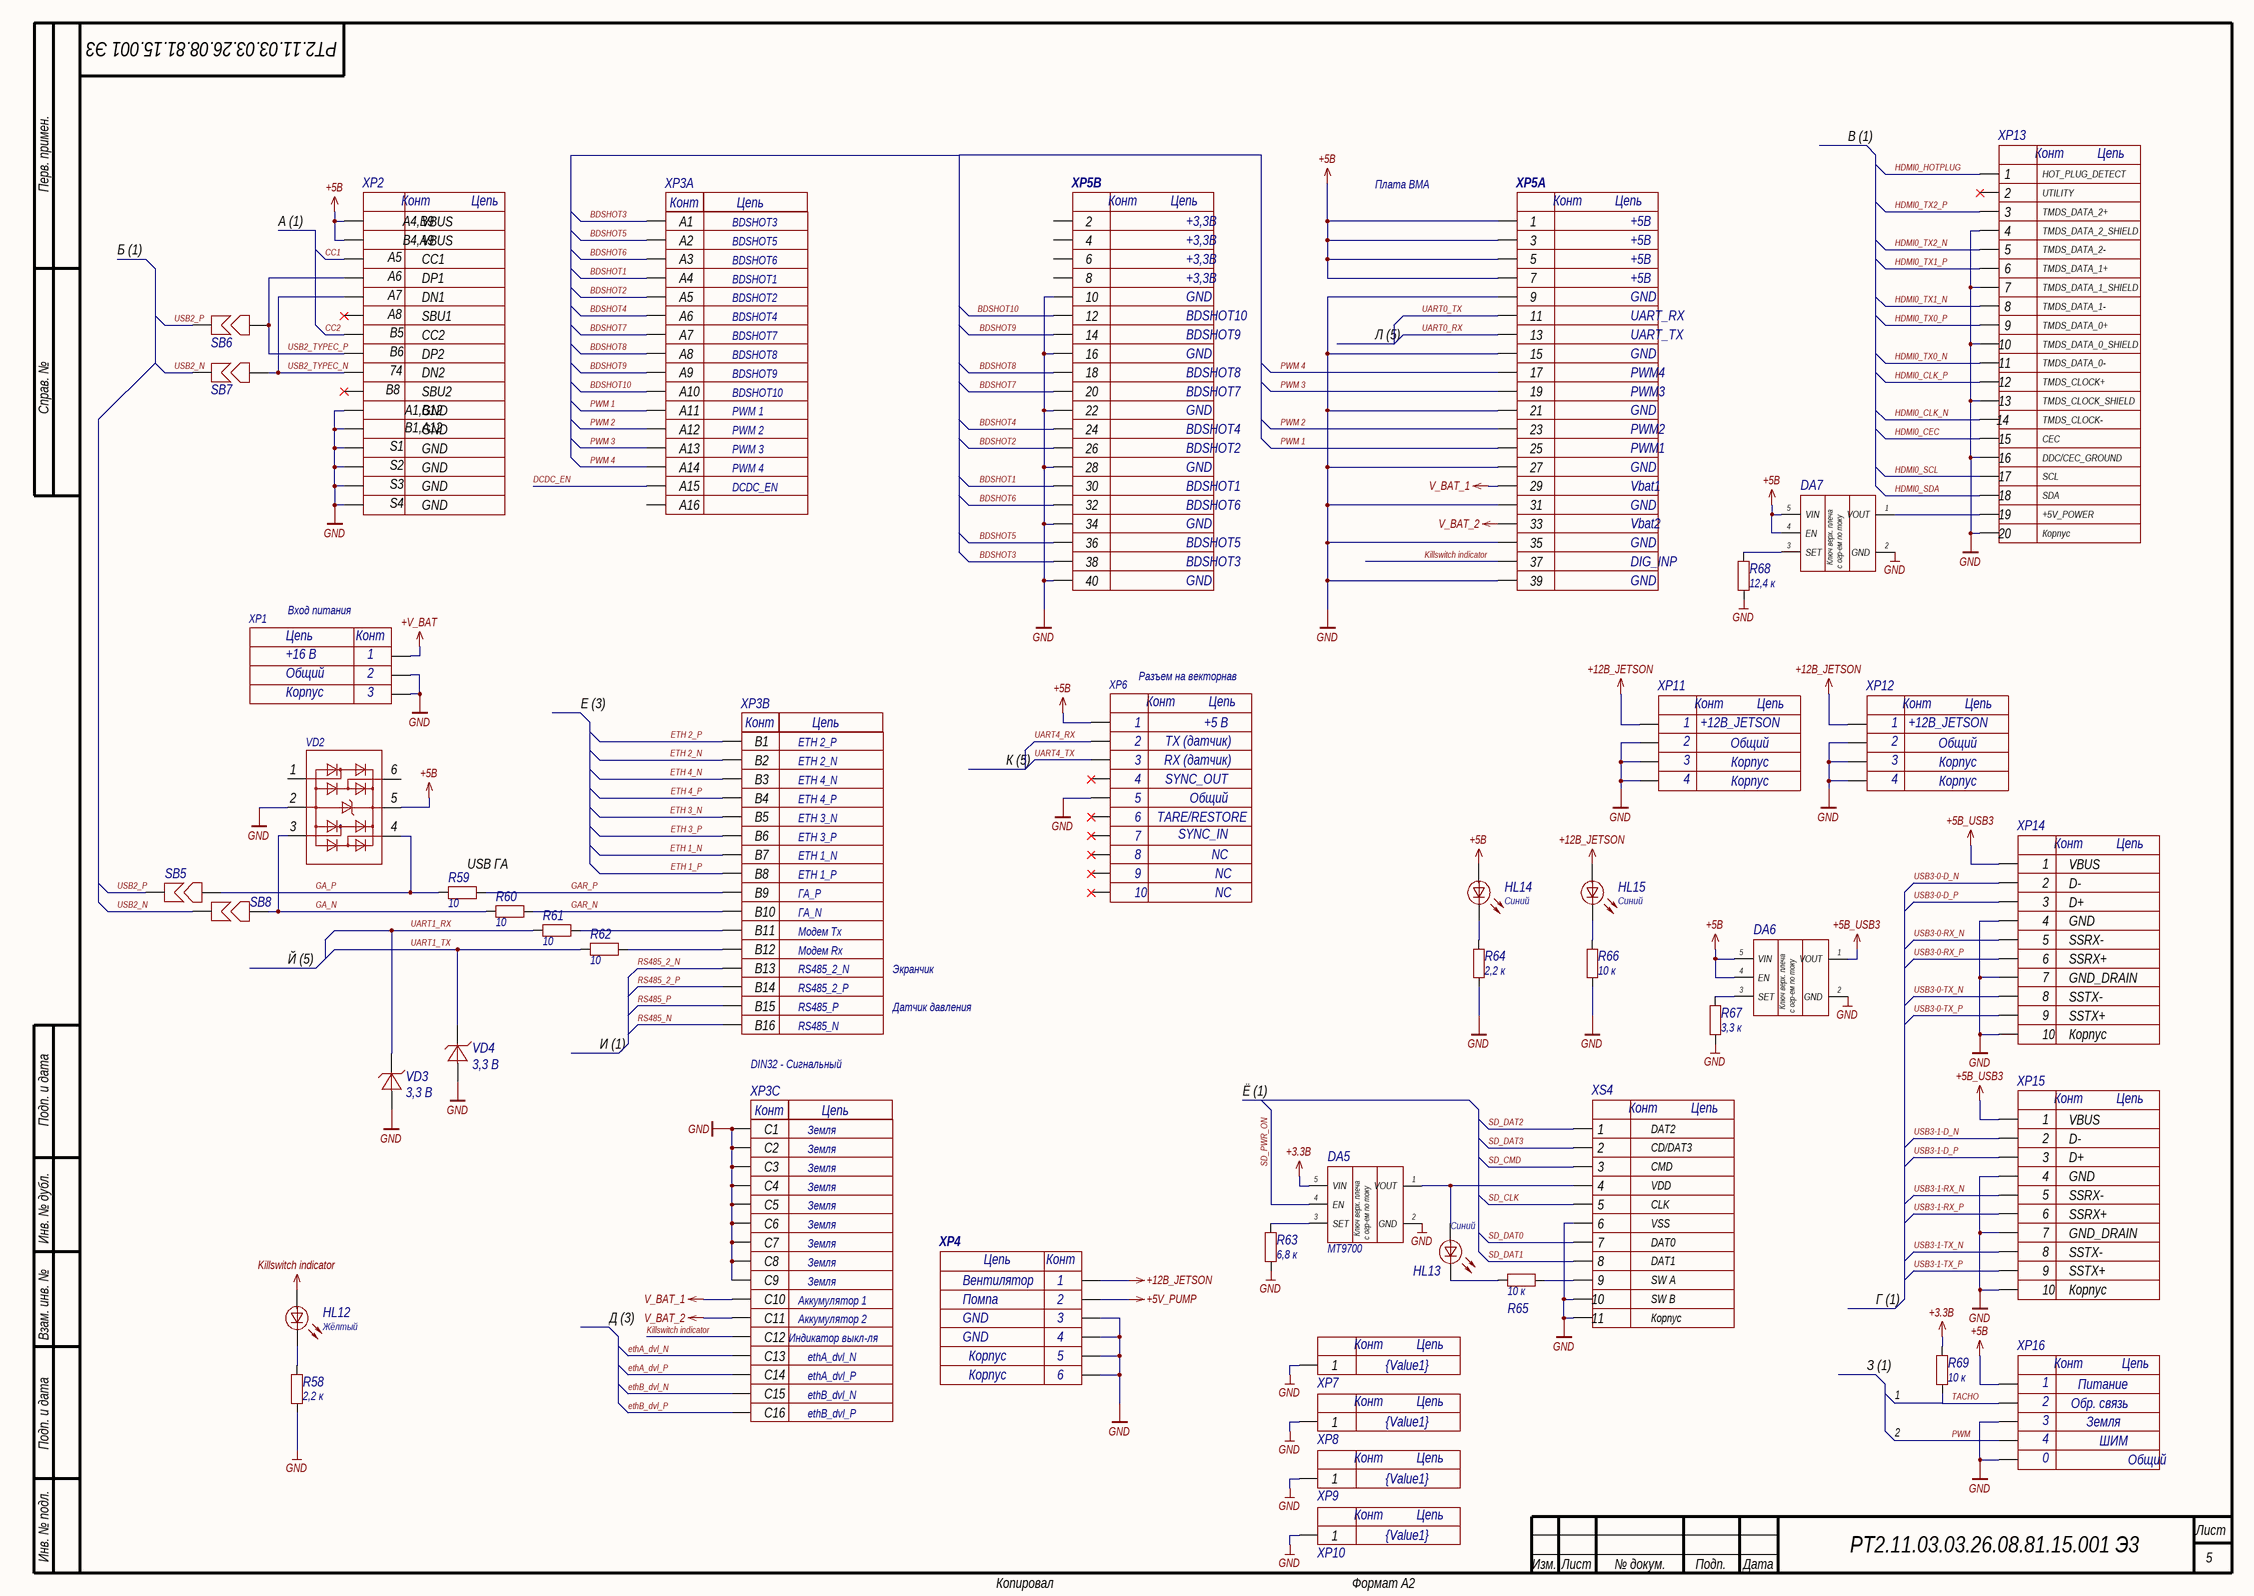
[diagram p5: connectors.SchDoc]

### Parts
DA5  MT9700  [SOT23-5]
DA6  MT9700  [SOT23-5]  (value not drawn)
DA7  MT9700  [SOT23-5]  (value not drawn)
HL12  value Жёлтый  [0603D_yellow]  (hidden comment: LED 0603 YELLOW)
HL13  value Синий  [0603D_blue]  (hidden comment: LED 0603 BLUE)
HL14  value Синий  [0603D_blue]  (hidden comment: LED 0603 BLUE)
HL15  value Синий  [0603D_blue]  (hidden comment: LED 0603 BLUE)
R58  value 2,2 к  [0603R]  (hidden comment: Resistor)
R59  value 10  [0603R]  (hidden comment: Resistor)
R60  value 10  [0603R]  (hidden comment: Resistor)
R61  value 10  [0603R]  (hidden comment: Resistor)
R62  value 10  [0603R]  (hidden comment: Resistor)
R63  value 6,8 к  [0603R]  (hidden comment: Resistor)
R64  value 2,2 к  [0603R]  (hidden comment: Resistor)
R65  value 10 к  [0603R]  (hidden comment: Resistor)
R66  value 10 к  [0603R]  (hidden comment: Resistor)
R67  value 3,3 к  [0603R]  (hidden comment: Resistor)
R68  value 12,4 к  [0603R]  (hidden comment: Resistor)
R69  value 10 к  [0603R]  (hidden comment: Resistor)
SB5  SB  [0603SB]  (value not drawn)  (net tie, no BOM)
SB6  SB  [0603SB]  (value not drawn)  (net tie, no BOM)
SB7  SB  [0603SB]  (value not drawn)  (net tie, no BOM)
SB8  SB  [0603SB]  (value not drawn)  (net tie, no BOM)
VD2  USBLC6-4  [SOT23-6]  (value not drawn)
VD3  value 3,3 В  [SOD523]  (hidden comment: PESD3V3L1UB)
VD4  value 3,3 В  [SOD523]  (hidden comment: PESD3V3L1UB)
XP1  Value3: Корпус  Value2: Общий  Value1: +16 В  [XT30PW-M]  (hidden comment: XT30PW-M)
XP2  USB_type_C_16PF-026  [16PF-026]  (value not drawn)
XP3  DIN41612_48_3row_right_angle_male  [DIN41612_48_3row_right_angle_male]  (value not drawn)  (parts A,B,C of 3)
XP4  Value1: Вентилятор  Value2: Помпа  Value3: GND  [MOLEX_430450418]  (hidden comment: 430450418)
XP5  DF40C-40DS  [DF40C-40DS]  (value not drawn)  (parts A,B of 2)
XP6  Value1: +5 В  Value2: TX (датчик)  Value3: RX (датчик)  Value4: SYNC_OUT  Value5: Общий  Value6: TARE/RESTORE  Value7: SYNC_IN  Value8: NC  [M80-4001042_govnodelie]  (hidden comment: M80-4001042)
XP7  Value1: {Value1}  [9774015151]  (hidden comment: SMT-NUT-M2H1.5)
XP8  Value1: {Value1}  [9774015151]  (hidden comment: SMT-NUT-M2H1.5)
XP9  Value1: {Value1}  [9774015151]  (hidden comment: SMT-NUT-M2H1.5)
XP10  Value1: {Value1}  [9774015151]  (hidden comment: SMT-NUT-M2H1.5)
XP11  Value3: Корпус  Value2: Общий  Value1: +12В_JETSON  [Molex_430450218]  (hidden comment: 430450218)
XP12  Value3: Корпус  Value2: Общий  Value1: +12В_JETSON  [Molex_430450218]  (hidden comment: 430450218)
XP13  467650001  [467650001]  (value not drawn)
XP14  USB 3.0A DS1095-05  [USB3.0A_DS1095-05]  (value not drawn)
XP15  USB 3.0A DS1095-05  [USB3.0A_DS1095-05]  (value not drawn)
XP16  Value3: Земля  Value2: Обр. связь  Value4: ШИМ  Value1: Питание  [BM04B-SRSS-TB]  (hidden comment: BM04B-SRSS-TB)
XS4  DM3AT-SF-PEJM5  [DM3AT-SF-PEJM5]  (value not drawn)

### Nets
+3.3В: DA5.5(VIN) R69.2
+5V_PUMP: XP4.2
+5В: DA6.4(EN) DA6.5(VIN) DA7.4(EN) DA7.5(VIN) HL14.1 VD2.5 XP2.A4/B9(VBUS) XP2.B4/A9(VBUS) XP5.1 XP5.3 XP5.5 XP5.7 XP6.1 XP16.1
+5В_USB3: DA6.1(VOUT) XP14.1(VBUS) XP15.1(VBUS)
+12В_JETSON: HL15.1 XP4.1 XP11.1 XP12.1
+V_BAT: XP1.P
GND: DA5.2(GND) DA6.2(GND) DA7.2(GND) R58.1 R63.1 R64.1 R66.1 R67.1 R68.1 VD2.2 VD3.1 VD4.1 XP1.0 XP1.N XP2.A1/B12(GND) XP2.B1/A12(GND) XP2.S1(GND) XP2.S2(GND) XP2.S3(GND) XP2.S4(GND) XP3.C1 XP3.C2 XP3.C3 XP3.C4 XP3.C5 XP3.C6 XP3.C7 XP3.C8 XP3.C9 XP4.0 XP4.3 XP4.4 XP5.9 XP5.10 XP5.15 XP5.16 XP5.21 XP5.22 XP5.27 XP5.28 XP5.31 XP5.34 XP5.35 XP5.39 XP5.40 XP6.5 XP7.1 XP8.1 XP9.1 XP10.1 XP11.0 XP11.2 XP12.0 XP12.2 XP13.4(TMDS_DATA_2_SHIELD) XP13.7(TMDS_DATA_1_SHIELD) XP13.10(TMDS_DATA_0_SHIELD) XP13.13(TMDS_CLOCK_SHIELD) XP13.16(DDC/CEC_GROUND) XP13.SH(Корпус) XP14.0(Корпус) XP14.4(GND) XP14.7(GND_DRAIN) XP15.0(Корпус) XP15.4(GND) XP15.7(GND_DRAIN) XP16.0 XP16.3 XS4.6(VSS) XS4.SH(Корпус) XS4.SWB(SW_B)
Killswitch indicator: HL12.1 XP3.C12 XP5.37
V_BAT_1: XP3.C10 XP5.29
V_BAT_2: XP3.C11 XP5.33
BDSHOT1: XP3.A4 XP5.30
BDSHOT2: XP3.A5 XP5.26
BDSHOT3: XP3.A1 XP5.38
BDSHOT4: XP3.A6 XP5.24
BDSHOT5: XP3.A2 XP5.36
BDSHOT6: XP3.A3 XP5.32
BDSHOT7: XP3.A7 XP5.20
BDSHOT8: XP3.A8 XP5.18
BDSHOT9: XP3.A9 XP5.14
BDSHOT10: XP3.A10 XP5.12
CC1: XP2.A5(CC1)
CC2: XP2.B5(CC2)
DCDC_EN: XP3.A15
ETH 1_N: XP3.B7
ETH 1_P: XP3.B8
ETH 2_N: XP3.B2
ETH 2_P: XP3.B1
ETH 3_N: XP3.B5
ETH 3_P: XP3.B6
ETH 4_N: XP3.B3
ETH 4_P: XP3.B4
ethA_dvl_N: XP3.C13
ethA_dvl_P: XP3.C14
ethB_dvl_N: XP3.C15
ethB_dvl_P: XP3.C16
GA_N: R60.1 SB8.1 VD2.3
GA_P: R59.1 SB5.1 VD2.4
GAR_N: R60.2 XP3.B10
GAR_P: R59.2 XP3.B9
HDMI0_CEC: XP13.15(CEC)
HDMI0_CLK_N: XP13.14(TMDS_CLOCK-)
HDMI0_CLK_P: XP13.12(TMDS_CLOCK+)
HDMI0_HOTPLUG: XP13.1(HOT_PLUG_DETECT)
HDMI0_SCL: XP13.17(SCL)
HDMI0_SDA: XP13.18(SDA)
HDMI0_TX0_N: XP13.11(TMDS_DATA_0-)
HDMI0_TX0_P: XP13.9(TMDS_DATA_0+)
HDMI0_TX1_N: XP13.8(TMDS_DATA_1-)
HDMI0_TX1_P: XP13.6(TMDS_DATA_1+)
HDMI0_TX2_N: XP13.5(TMDS_DATA_2-)
HDMI0_TX2_P: XP13.3(TMDS_DATA_2+)
PWM: XP16.4
PWM 1: XP3.A11 XP5.25
PWM 2: XP3.A12 XP5.23
PWM 3: XP3.A13 XP5.19
PWM 4: XP3.A14 XP5.17
RS485_2_N: XP3.B13
RS485_2_P: XP3.B14
RS485_N: XP3.B16
RS485_P: XP3.B15
SD_CLK: XS4.5(CLK)
SD_CMD: XS4.3(CMD)
SD_DAT0: XS4.7(DAT0)
SD_DAT1: XS4.8(DAT1)
SD_DAT2: XS4.1(DAT2)
SD_DAT3: XS4.2(CD/DAT3)
SD_PWR_ON: DA5.4(EN)
TACHO: R69.1 XP16.2
UART0_RX: XP5.13
UART0_TX: XP5.11
UART1_RX: R61.1 VD3.2
UART1_TX: R62.1 VD4.2
UART4_RX: XP6.2
UART4_TX: XP6.3
USB2_N: SB7.2 SB8.2
USB2_P: SB5.2 SB6.2
USB2_TYPEC_N: SB7.1 XP2.A7(DN1) XP2.B7(DN2)
USB2_TYPEC_P: SB6.1 XP2.A6(DP1) XP2.B6(DP2)
USB3-0-D_N: XP14.2(D-)
USB3-0-D_P: XP14.3(D+)
USB3-0-RX_N: XP14.5(SSRX-)
USB3-0-RX_P: XP14.6(SSRX+)
USB3-0-TX_N: XP14.8(SSTX-)
USB3-0-TX_P: XP14.9(SSTX+)
USB3-1-D_N: XP15.2(D-)
USB3-1-D_P: XP15.3(D+)
USB3-1-RX_N: XP15.5(SSRX-)
USB3-1-RX_P: XP15.6(SSRX+)
USB3-1-TX_N: XP15.8(SSTX-)
USB3-1-TX_P: XP15.9(SSTX+)
NetDA5_1: DA5.1(VOUT) HL13.1 XS4.4(VDD)
NetDA5_3: DA5.3(SET) R63.2
NetDA6_3: DA6.3(SET) R67.2
NetDA7_1: DA7.1(VOUT) XP13.19(+5V_POWER)
NetDA7_3: DA7.3(SET) R68.2
NetHL12_2: HL12.2 R58.2
NetHL13_2: HL13.2 R65.1
NetHL14_2: HL14.2 R64.2
NetHL15_2: HL15.2 R66.2
NetR61_2: R61.2 XP3.B11
NetR62_2: R62.2 XP3.B12
NetR65_2: R65.2 XS4.SWA(SW_A)

Not connected (* = marked no-connect by the designer): VD2 1(9) 6(14); XP2 A8(SBU1)* B8(SBU2)*; XP3 A16; XP5 2 4 6 8; XP6 4* 6* 7* 8* 9* 10*; XP13 2(UTILITY)*

### Notes on the sheet
- В (1)
- Плата ВМА
- Б (1)
- А (1)
- BDSHOT3
- BDSHOT5
- BDSHOT6
- BDSHOT1
- BDSHOT2
- BDSHOT4
- BDSHOT7
- BDSHOT8
- Л (5)
- BDSHOT9
- BDSHOT10
- PWM 1
- PWM 2
- PWM 3
- PWM 4
- DCDC_EN
- Вход питания
- Разъем на векторнав
- Е (3)
- ETH 2_P
- ETH 2_N
- ETH 4_N
- К (5)
- ETH 4_P
- ETH 3_N
- ETH 3_P
- (near R59) USB ГА
- ETH 1_N
- ETH 1_P
- ГА_P
- ГА_N
- Модем Tx
- Й (5)
- Модем Rx
- RS485_2_N
- Экранчик
- RS485_N
- RS485_P
- RS485_2_P
- Датчик давления
- И (1)
- (near XP3) DIN32 - Сигнальный
- Ё (1)
- Земля
- Д (3)
- Аккумулятор 1
- Аккумулятор 2
- Г (1)
- (near XP3) Индикатор выкл-ля
- ethA_dvl_N
- З (1)
- ethB_dvl_P
- ethB_dvl_N
- ethA_dvl_P
- 1
- 2
- Перв. примен.
- Справ. №
- Подп. и дата
- Инв. № дубл.
- Взам. инв. №
- Инв. № подл.
- Изм.
- Лист
- № докум.
- Подп.
- Дата
- Копировал
- Формат А2
- (in symbol 467650001_microHDMI) Конт; Цепь; 20
- (in symbol BM04B-SRSS-TB) Конт; Цепь; Общий
- (in symbol DF40C-40DS, part A) Конт; Цепь; +5В; GND; UART_RX; UART_TX; PWM4; PWM3; PWM2; PWM1; Vbat1; Vbat2; DIG_INP
- (in symbol DF40C-40DS, part B) Конт; Цепь; +3,3В; GND; BDSHOT10; BDSHOT9; BDSHOT8; BDSHOT7; BDSHOT4; BDSHOT2; BDSHOT1; BDSHOT6; BDSHOT5; BDSHOT3
- (in symbol DIN41612_48_3row_right_angle_male, part A) Конт; Цепь
- (in symbol DIN41612_48_3row_right_angle_male, part B) Конт; Цепь
- (in symbol DIN41612_48_3row_right_angle_male, part C) Конт; Цепь
- (in symbol DM3AT-SF-PEJM5) Конт; Цепь; 9; 10; 11
- (in symbol Fucking M80-4001042) Конт; Цепь
- (in symbol Molex_430450218) Конт; Цепь; 3; 4
- (in symbol Molex_430450418) Цепь; Конт; Корпус; 5; 6
- (in symbol MT9700) Ключ верх. плеча; с огр-ем по току
- (in symbol SMT-NUT-M2H1.5) Конт; Цепь
- (in symbol USB 3.0A DS1095-05) Конт; Цепь; 10
- (in symbol USB_type_C_16PF-026) Конт; Цепь; A4,B9; B4,A9; 74; A1,B12; B1,A12
- (in symbol XT30PW-M) Цепь; Конт; 1; 2; 3

### Library data of the parts
DA5-DA7 = MT9700: Силовой ключ с настраиваемым ограничением тока, 2А(max), SOT-23-5; Автор: rreali; Part Number: MT9700; Datasheet: https://static.chipdip.ru/lib/498/DOC013498591.pdf
HL12 = LED 0603 YELLOW: Светодиод 0603 Жёлтый; Автор: rreali; Part Number: LED 0603 YELLOW
HL13-HL15 = LED 0603 BLUE: Светодиод 0603 Синий; Автор: rreali; Part Number: LED 0603 BLUE
R58 R64 = Resistor_2.2k_1_0603: Резистор номиналом 2,2 кОм 1%; Power: *; Part Number: Resistor_2.2k_1_0603; Tolerance: 1%
R59-R62 = Resistor_10_1_0603: Резистор номиналом 10 Ом 1%; Power: *; Part Number: Resistor_10_1_0603; Tolerance: 1%
R63 = Resistor_6.8k_1_0603: Резистор номиналом 6,8 кОм 1%; Power: *; Part Number: Resistor_6.8k_1_0603; Tolerance: 1%
R65 R66 R69 = Resistor_10k_1_0603: Резистор номиналом 10 кОм 1%; Power: *; Part Number: Resistor_10k_1_0603; Tolerance: 1%
R67 = Resistor_3.3k_1_0603: Резистор номиналом 3,3 кОм 1%; Power: *; Part Number: Resistor_3.3k_1_0603; Tolerance: 1%
R68 = Resistor_12.4k_1_0603: Резистор номиналом 12,4 кОм 1%; Power: *; Part Number: Resistor_12.4k_1_0603; Tolerance: 1%
SB5-SB8 = SB: as SB1 on sheet cm5; Part Number: SB
VD2 = USBLC6-4: Сборка защитных диодов для USB; ComponentLink1Description: Shop; ComponentLink1URL: https://www.chipdip.ru/product0/8001780508; Part Number: USBLC6-4
VD3 VD4 = PESD3V3L1UB: Защитный диод на 3,3 В, рассеиваемая мощность 45 Вт; Voltage (V): 3,3; Power (W): 45; Автор: glebmih; Part Number: PESD3V3L1UB
XP1 = XT30PW-M: 30 А (15 продолжительно), 2 контакта разъем угловой отец; System: Connector; Автор: rreali; Part Number: XT30PW-M
XP2 = USB_type_C_16PF-026: USB2.0 TYPE-C 16PF-026, Разъём USB TYPE-C - розетка в плату; System: Connector; Автор: rreali; Part Number: USB_type_C_16PF-026; Datasheet: https://ruichi.ru/files/107841-716042290d9ed014628a96fd01272154.pdf
XP3 = DIN41612_48_3row_right_angle_male: DIN41612R (DS1120-48M0R13), Разъем (вилка) тип B 48pin (3х16), шаг 2.54мм трехрядный угловой (ряд АВC); Parameter 14: {Value}; System: Connector; Автор: glebmih; Parameter 16: {Value}; Parameter 15: {Value}; Parameter 12: {Value}; Parameter 13: {Value}; Parameter 11: {Value}; Parameter 10: {Value}; Parameter 9: {Value}; Parameter 8: {Value}; Parameter 5: {Value}; Parameter 6: {Value}; Parameter 7: {Value}; Parameter 4: {Value}; Parameter 3: {Value}; Parameter 2: {Value}; Parameter 1: {Value}; Part Number: DIN41612_48_3row_right_angle_male; Datasheet: https://cdn.promelec.ru/upload/datasheet/3/1/DS1120.pdf
XP4 = Molex_430450418: Разъем типа провод-плата, 3 мм, 4 контакт(-ов), Штыревой Разъем, для поверностного монтажа; System: Connector; Автор: rreali; Value4: GND; Part Number: Molex_430450418
XP5 = DF40C-40DS: Thruster control PCB
XP6 = Fucking M80-4001042: 5+5-контактный гнездовой DIL-разъём с вертикальным сквозным креплением. Посадочное под нестандартные длинные винты м2, чтобы шляпка винта прижималась к плате, а не к разъему. Так выше жесткость.; System: Connector; Автор: rreali; Value9: NC; Value10: NC; Part Number: Fucking M80-4001042; Datasheet: https://www.harwin.com/products/M80-4001042
XP7-XP10 = SMT-NUT-M2H1.5: Стойка под пайку, М2, высота 1.5 мм, SMT spacer nut - ключевые слова, Hangzhou WildChip Tech Co., Ltd. Store магазин на алике; Автор: glebmih; Part Number: SMT-NUT-M2H1.5; Datasheet: https://aliexpress.ru/item/1005005620368789.html?sku_id=12000033777723210&srcSns=sns_More&businessType=ProductDetail&spreadType=socialShare&tt=MG&utm_medium=sharing
XP11 XP12 = Molex_430450218: Разъем типа провод-плата, 3 мм, 2 контакт(-ов), Штыревой Разъем, Серия Micro-Fit для поверхностного монтажа; System: Connector; Автор: rreali; Value4: Корпус; Part Number: Molex_430450218
XP13 = 467650001_microHDMI: Разъем Micro HDMI с шагом контактов 0,40 мм, угловой разъем, для поверхностного монтажа, 19 контактов; System: Connector; Автор: rreali; Part Number: 467650001_microHDMI; Datasheet: https://www.molex.com/content/dam/molex/molex-dot-com/products/automated/en-us/salesdrawingpdf/467/46765/467650001_sd.pdf?inline
XP14 XP15 = USB 3.0A DS1095-05: Разъем USB 3.0 тип A, 9 контактов, мама, угловой.; System: Connector; Автор: rreali; Part Number: USB 3.0A DS1095-05; Datasheet: https://static.chipdip.ru/lib/553/DOC059553898.pdf
XP16 = BM04B-SRSS-TB: Разъем штыревой на плату, поверхностый монтаж, вертикальный, 4 контакта, шаг 1 мм; System: Connector; Автор: rreali; Part Number: BM04B-SRSS-TB; Datasheet: https://static.chipdip.ru/lib/149/DOC007149929.pdf
XS4 = DM3AT-SF-PEJM5: Разъем для microSD карты памяти угл.8к.1.1мм SMT; System: Connector; Автор: rreali; Part Number: DM3AT-SF-PEJM5; Datasheet: https://static.chipdip.ru/lib/795/DOC059795377.pdf

## Sheet DCDC_Jetson.SchDoc: Материнская плата аппарата NeoWelt v.2
size 420 x 297 mm; Address1: Address1; Address2: Address2; Address3: Address3; Address4: Address4; DocumentNumber: 6; SheetNumber: 6; SheetTotal: 6; Перв_применение: РТ2.11.03.03.26.08.81.15.001 Э3
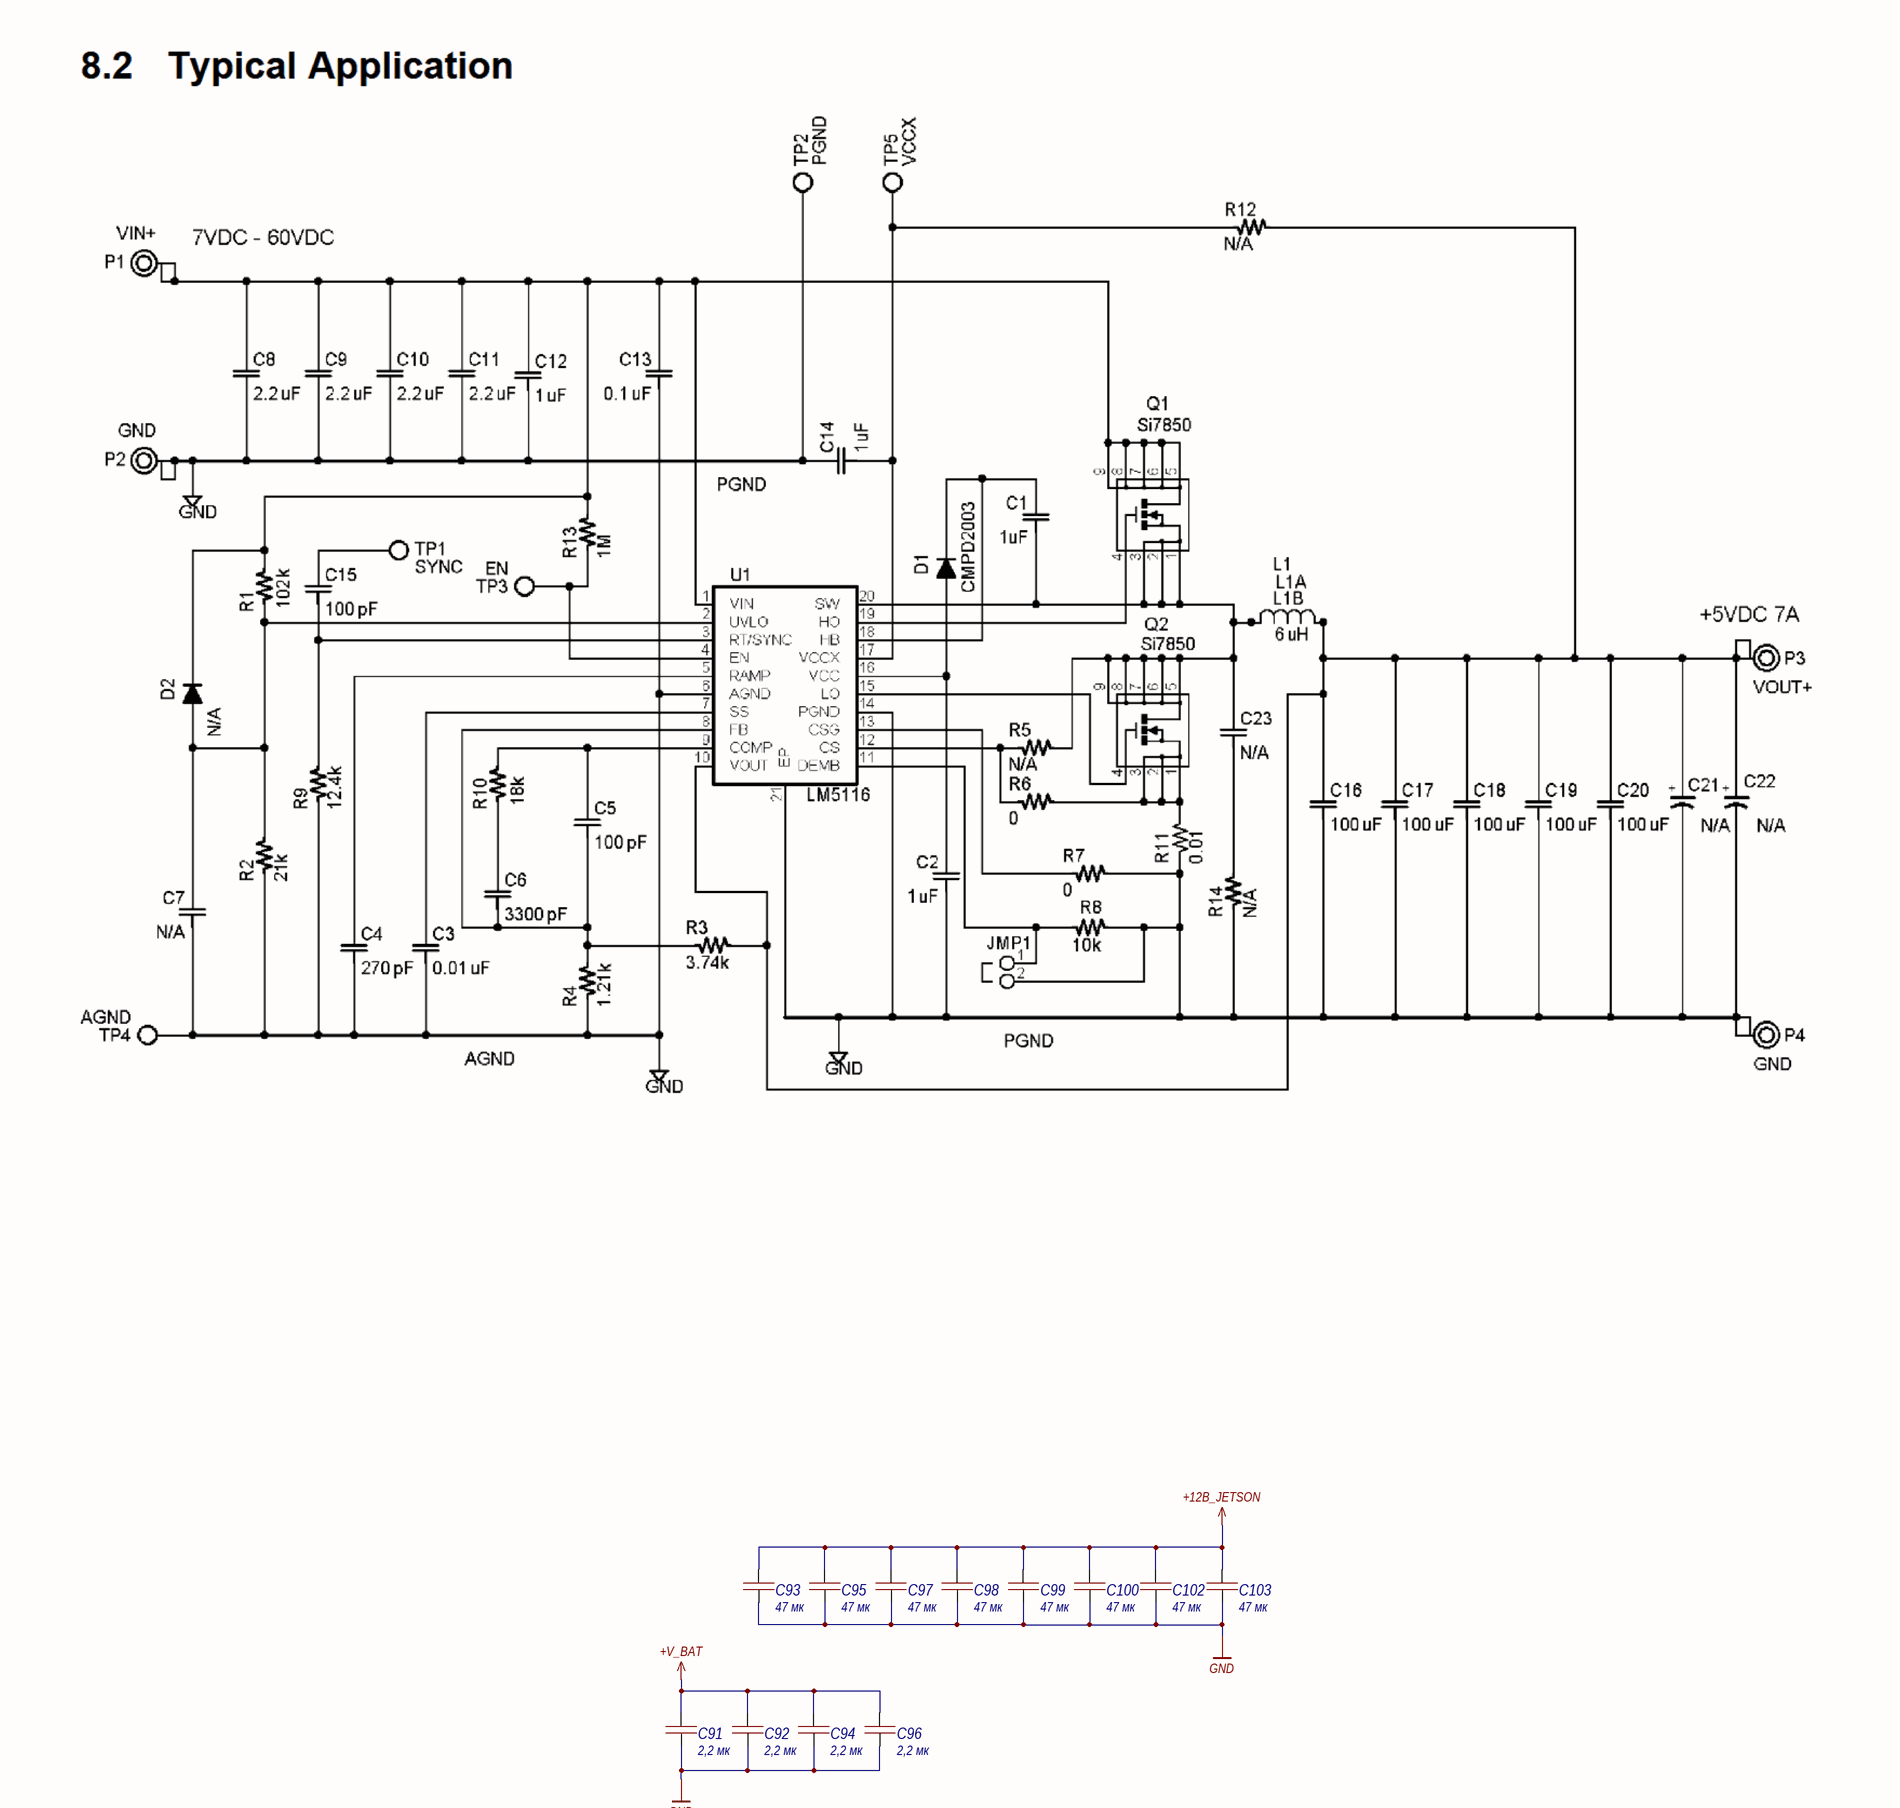
[diagram p6: DCDC_Jetson.SchDoc, top]
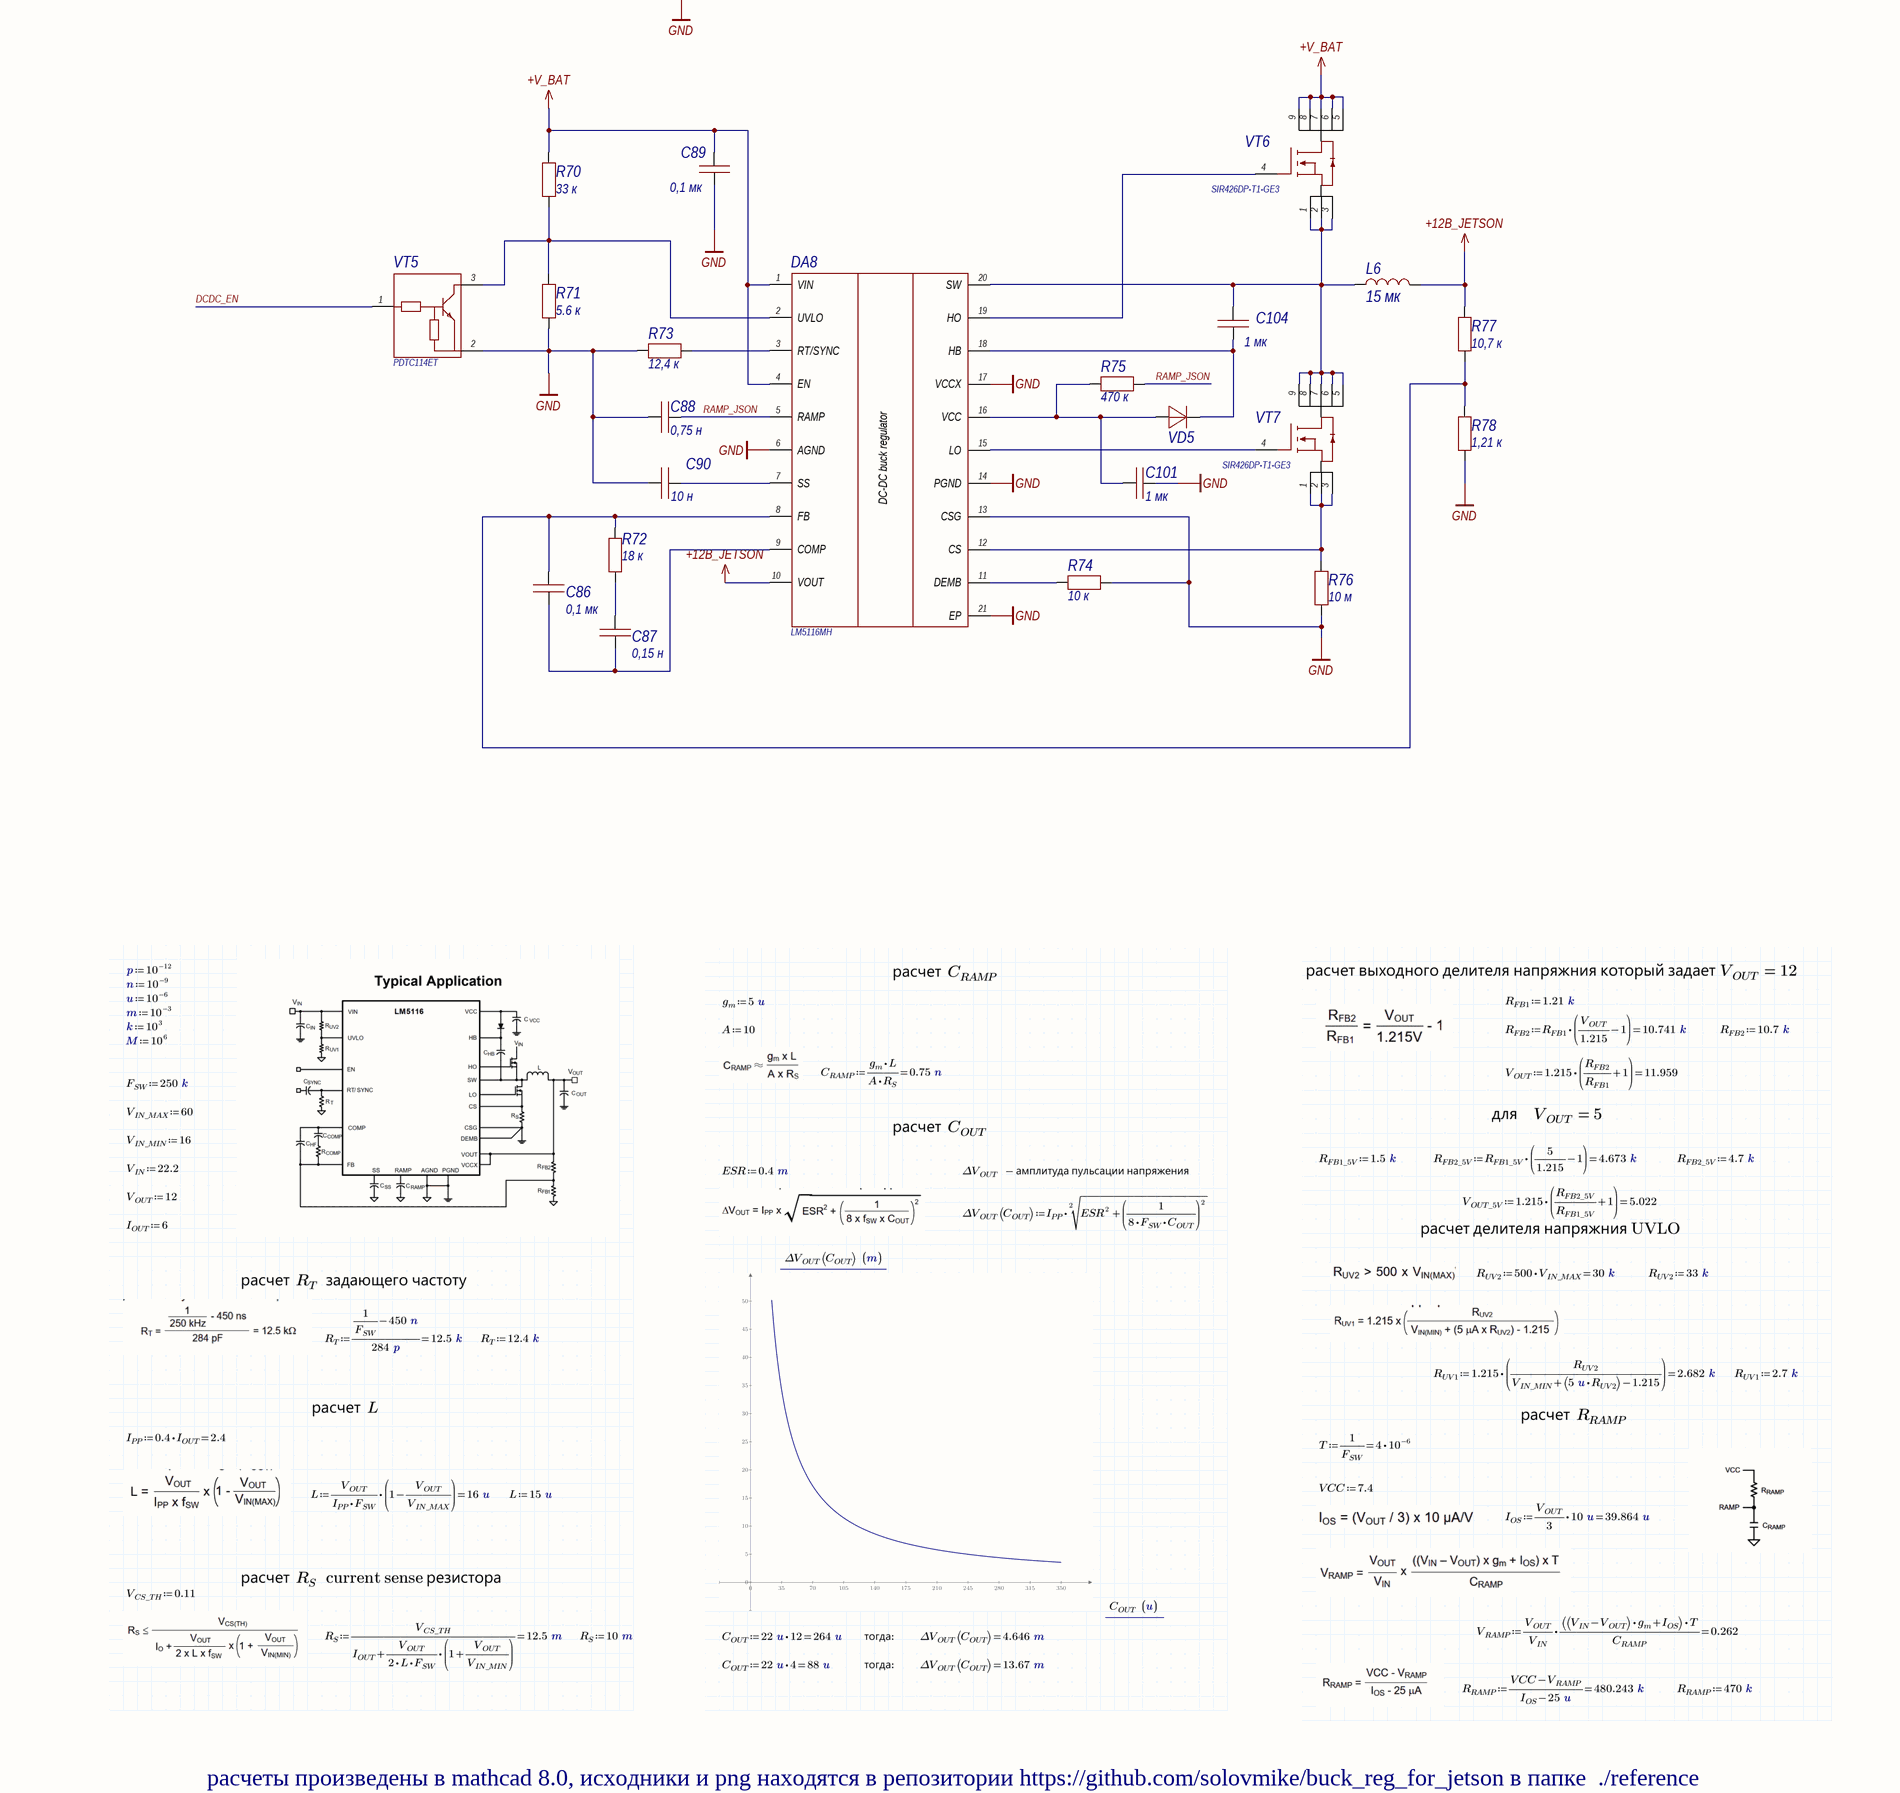
[diagram p7: DCDC_Jetson.SchDoc, bottom]

### Parts
C86  value 0,1 мк  [0603C]  (hidden comment: Capacitor)
C87  value 0,15 н  [0603C]  (hidden comment: Capacitor)
C88  value 0,75 н  [0603C]  (hidden comment: Capacitor)
C89  value 0,1 мк  [0603C]  (hidden comment: Capacitor)
C90  value 10 н  [0603C]  (hidden comment: Capacitor)
C91  value 2,2 мк  [1206C]  (hidden comment: Capacitor)
C92  value 2,2 мк  [1206C]  (hidden comment: Capacitor)
C93  value 47 мк  [1206C]  (hidden comment: GRM31CR61E476ME44L)
C94  value 2,2 мк  [1206C]  (hidden comment: Capacitor)
C95  value 47 мк  [1206C]  (hidden comment: GRM31CR61E476ME44L)
C96  value 2,2 мк  [1206C]  (hidden comment: Capacitor)
C97  value 47 мк  [1206C]  (hidden comment: GRM31CR61E476ME44L)
C98  value 47 мк  [1206C]  (hidden comment: GRM31CR61E476ME44L)
C99  value 47 мк  [1206C]  (hidden comment: GRM31CR61E476ME44L)
C100  value 47 мк  [1206C]  (hidden comment: GRM31CR61E476ME44L)
C101  value 1 мк  [0603C]  (hidden comment: Capacitor)
C102  value 47 мк  [1206C]  (hidden comment: GRM31CR61E476ME44L)
C103  value 47 мк  [1206C]  (hidden comment: GRM31CR61E476ME44L)
C104  value 1 мк  [0603C]  (hidden comment: Capacitor)
DA8  LM5116MH  [HTSSOP-20]
L6  value 15 мк  [IHLP-4040]  (hidden comment: IHLP4040DZER150M11)
R70  value 33 к  [0603R]  (hidden comment: Resistor)
R71  value 5.6 к  [0603R]  (hidden comment: Resistor)
R72  value 18 к  [0603R]  (hidden comment: Resistor)
R73  value 12,4 к  [0603R]  (hidden comment: Resistor)
R74  value 10 к  [0603R]  (hidden comment: Resistor)
R75  value 470 к  [0603R]  (hidden comment: Resistor)
R76  value 10 м  [1210R]  (hidden comment: Resistor)
R77  value 10,7 к  [0603R]  (hidden comment: Resistor)
R78  value 1,21 к  [0603R]  (hidden comment: Resistor)
VD5  S1GFL  [SOD-123F]  (value not drawn)
VT5  PDTC114ET  [SOT23-3]
VT6  SIR426DP-T1-GE3  [PowerPAK_SO-8]
VT7  SIR426DP-T1-GE3  [PowerPAK_SO-8]

### Nets
+12В_JETSON: C93.2 C95.2 C97.2 C98.2 C99.2 C100.2 C102.2 C103.2 DA8.10(VOUT) L6.2 R77.2
+V_BAT: C89.2 C91.2 C92.2 C94.2 C96.2 DA8.1(VIN) DA8.4(EN) R70.2 VT6.5 VT6.6 VT6.7 VT6.8 VT6.9
GND: C88.1 C89.1 C90.1 C91.1 C92.1 C93.1 C94.1 C95.1 C96.1 C97.1 C98.1 C99.1 C100.1 C101.2 C102.1 C103.1 DA8.6(AGND) DA8.13(CSG) DA8.14(PGND) DA8.17(VCCX) DA8.21(EP) R71.1 R73.1 R74.2 R76.1 R78.1 VT5.2(E)
DCDC_EN: VT5.1(B)
RAMP_JSON: C88.2 DA8.5(RAMP) R75.2
NetC86_1: C86.1 C87.1 DA8.9(COMP)
NetC86_2: C86.2 DA8.8(FB) R72.2 R77.1 R78.2
NetC87_2: C87.2 R72.1
NetC90_2: C90.2 DA8.7(SS)
NetC101_1: C101.1 DA8.16(VCC) R75.1 VD5.1
NetC104_1: C104.1 DA8.18(HB) VD5.2
NetC104_2: C104.2 DA8.20(SW) L6.1 VT6.1 VT6.2 VT6.3 VT7.5 VT7.6 VT7.7 VT7.8 VT7.9
NetDA8_2: DA8.2(UVLO) R70.1 R71.2 VT5.3(C)
NetDA8_3: DA8.3(RT/SYNC) R73.2
NetDA8_11: DA8.11(DEMB) R74.1
NetDA8_12: DA8.12(CS) R76.2 VT7.1 VT7.2 VT7.3
NetDA8_15: DA8.15(LO) VT7.4
NetDA8_19: DA8.19(HO) VT6.4

### Notes on the sheet
- расчеты произведены в mathcad 8.0, исходники и png находятся в репозитории https://github.com/solovmike/buck_reg_for_jetson в папке  ./reference
- Перв. примен.
- Справ. №
- Подп. и дата
- Инв. № дубл.
- Взам. инв. №
- Инв. № подл.
- Изм.
- Лист
- № докум.
- Подп.
- Дата
- Копировал
- Формат А3
- (in symbol LM5116MH) DC-DC buck regulator

### Library data of the parts
C86 = Capacitor_0,1u_10_50V_X7R_0603C: as C5 on sheet cm5; Part Number: Capacitor_0,1u_10_50V_X7R_0603C; Tolerance: 10%; Dielectric: X7R
C87 = Capacitor_0,15n_10_50V_X7R_0603C: Конденсатор; Library Path2: Schematic\Capacitor.SchLib; Tolerance: 0,1; Voltage (V): 50; Dielectric: X7R; Capacity (nF): 0,15; Part Number: Capacitor_0,15n_10_50V_X7R_0603C
C88 = Capacitor_0,75n_10_50V_X7R_0603C: Конденсатор; Library Path2: Schematic\Capacitor.SchLib; Tolerance: 0,1; Voltage (V): 50; Dielectric: X7R; Capacity (nF): 0,75; Part Number: Capacitor_0,75n_10_50V_X7R_0603C
C89 = Capacitor_0,1u_10_50V_X7R_0603C: Конденсатор; Library Path2: Schematic\Capacitor.SchLib; Tolerance: 0,1; Voltage (V): 50; Dielectric: X7R; Capacity (nF): 100; Part Number: Capacitor_0,1u_10_50V_X7R_0603C
C90 = Capacitor_10n_10_50V_X7R_0603C: Конденсатор; Library Path2: Schematic\Capacitor.SchLib; Tolerance: 0,1; Voltage (V): 50; Dielectric: X7R; Capacity (nF): 10; Part Number: Capacitor_10n_10_50V_X7R_0603C
C91 C92 C94 C96 = Capacitor_2,2u_10_50V_X7R_1206C: Конденсатор 1206C ёмкостью 2,2 мк 10%, 50 В, X7R; Voltage (V): 50; Capacity (nF): 2200; Part Number: Capacitor_2,2u_10_50V_X7R_1206C; Tolerance: 10%; Dielectric: X7R
C93 C95 C97-C100 C102 C103 = GRM31CR61E476ME44L: Конденсатор 1206C ёмкостью 47 мк 20%, 25 В, X5R; Voltage (V): 25; Capacity (nF): 47000; Автор: rreali; Datasheet: https://cdn.promelec.ru/upload/items/2020/02/18/MURATA_MLCC_catalog_C02E_short_.pdf; Part Number: GRM31CR61E476ME44L; Tolerance: 20%; Dielectric: X5R
C101 C104 = Capacitor_1u_10_50V_X7R_0603C: Конденсатор; Library Path2: Schematic\Capacitor.SchLib; Tolerance: 0,1; Voltage (V): 50; Dielectric: X7R; Capacity (nF): 1000; Part Number: Capacitor_1u_10_50V_X7R_0603C
DA8 = LM5116MH: dc-dc понижающий adj 6-100v; Manufacturer_Part_Number: LM5116MH/NOPB; Part Number: LM5116MH
L6 = IHLP4040DZER150M11: Катушка индуктивности SMD экранированная 15мкГн ±20% 6,25A 45мОм; Inductance (μH): 15; Current: 6,25 А; Автор: rreali; Part Number: IHLP4040DZER150M11; Datasheet: cdn.promelec.ru/upload/datasheet/1/f/lp40dz11.pdf
R70 = Resistor_33k_1_0603: Резистор номиналом 33 кОм и точностью 1%; Power: *; Part Number: Resistor_33k_1_0603; Tolerance: 1%
R71 = Resistor_2.7k_1_0603: Резистор номиналом 2,7 кОм и точностью 1%; Power: *; Part Number: Resistor_2.7k_1_0603; Tolerance: 1%
R72 = Resistor_18k_1_0603: Резистор номиналом 18 кОм 1%; Power: *; Part Number: Resistor_18k_1_0603; Tolerance: 1%
R73 = Resistor_12.4k_1_0603: Резистор номиналом 12,4 кОм и точностью 1%; Power: *; Part Number: Resistor_12.4k_1_0603; Tolerance: 1%
R74 = Resistor_10k_1_0603: Резистор номиналом 10 кОм и точностью 1%; Power: *; Part Number: Resistor_10k_1_0603; Tolerance: 1%
R75 = Resistor_470k_1_0603: Резистор номиналом 470 кОм и точностью 1%; Power: *; Part Number: Resistor_470k_1_0603; Tolerance: 1%
R76 = RL1210FR-070R01L: Резистор номиналом 10 мОм, точностью 1%, 0.5Вт; Power: *; Part Number: RL1210FR-070R01L; Tolerance: 1%
R77 = Resistor_10.7k_1_0603: Резистор номиналом 10,7 кОм 1%; Power: *; Part Number: Resistor_10.7k_1_0603; Tolerance: 1%
R78 = Resistor_1.21k_1_0603: Резистор номиналом 1,21 кОм 1%; Power: *; Part Number: Resistor_1.21k_1_0603; Tolerance: 1%
VD5 = S1GFL: Диод 400В 1A [SOD-123F]; Voltage (V): 400; Current: 1 А; Автор: rreali; Part Number: S1GFL; Datasheet: https://static.chipdip.ru/lib/868/DOC011868843.pdf
VT5 = PDTC114ET: as VT4 on sheet dc-dc_eth+pump; Part Number: PDTC114ET; Voltage (V): 50 В
VT6 VT7 = SIR426DP-T1-GE3: Транзистор полевой MOSFET N-канальный 40В 41.7Вт; Part Number: SIR426DP-T1-GE3; Напряжение С-И/К-Э: 40 В

## Nets that join several sheets
+3.3В: cm5 (5 pins), connectors (DA5.5 R69.2)
+5V_PUMP: dc-dc_eth+pump (5 pins), connectors (XP4.2)
+5В: cm5 (15 pins), connectors (14 pins)
+12В_JETSON: connectors (HL15.1 XP4.1 XP11.1 XP12.1), DCDC_Jetson (11 pins)
+V_BAT: dc-dc_eth+pump (9 pins), connectors (XP1.P), DCDC_Jetson (13 pins)
GND: cm5 (94 pins), dc-dc_eth+pump (19 pins), connectors (71 pins), DCDC_Jetson (27 pins)
CC1: cm5 (DD1.94), connectors (XP2.A5)
CC2: cm5 (DD1.96), connectors (XP2.B5)
DCDC_EN: dc-dc_eth+pump (VT4.1), connectors (XP3.A15), DCDC_Jetson (VT5.1)
HDMI0_CEC: cm5 (DD1.151), connectors (XP13.15)
HDMI0_CLK_N: cm5 (DD1.190), connectors (XP13.14)
HDMI0_CLK_P: cm5 (DD1.188), connectors (XP13.12)
HDMI0_HOTPLUG: cm5 (DD1.153), connectors (XP13.1)
HDMI0_SCL: cm5 (DD1.200), connectors (XP13.17)
HDMI0_SDA: cm5 (DD1.199), connectors (XP13.18)
HDMI0_TX0_N: cm5 (DD1.184), connectors (XP13.11)
HDMI0_TX0_P: cm5 (DD1.182), connectors (XP13.9)
HDMI0_TX1_N: cm5 (DD1.178), connectors (XP13.8)
HDMI0_TX1_P: cm5 (DD1.176), connectors (XP13.6)
HDMI0_TX2_N: cm5 (DD1.172), connectors (XP13.5)
HDMI0_TX2_P: cm5 (DD1.170), connectors (XP13.3)
PWM: cm5 (DD1.19), connectors (XP16.4)
RS485_2_N: cm5 (DD4.7 R10.2), connectors (XP3.B13)
RS485_2_P: cm5 (DD4.6 R10.1), connectors (XP3.B14)
RS485_N: cm5 (DD3.7 R9.2), connectors (XP3.B16)
RS485_P: cm5 (DD3.6 R9.1), connectors (XP3.B15)
SD_CLK: cm5 (DD1.57), connectors (XS4.5)
SD_CMD: cm5 (DD1.62), connectors (XS4.3)
SD_DAT0: cm5 (DD1.63), connectors (XS4.7)
SD_DAT1: cm5 (DD1.67), connectors (XS4.8)
SD_DAT2: cm5 (DD1.69), connectors (XS4.1)
SD_DAT3: cm5 (DD1.61), connectors (XS4.2)
SD_PWR_ON: cm5 (DD1.75), connectors (DA5.4)
TACHO: cm5 (DD1.16), connectors (R69.1 XP16.2)
UART0_RX: cm5 (DD1.51), connectors (XP5.13)
UART0_TX: cm5 (DD1.55), connectors (XP5.11)
UART1_RX: cm5 (DD1.35), connectors (R61.1 VD3.2)
UART1_TX: cm5 (DD1.36), connectors (R62.1 VD4.2)
UART4_RX: cm5 (DD1.28), connectors (XP6.2)
UART4_TX: cm5 (DD1.31), connectors (XP6.3)
USB2_N: cm5 (DD1.103), connectors (SB7.2 SB8.2)
USB2_P: cm5 (DD1.105), connectors (SB5.2 SB6.2)
USB3-0-D_N: cm5 (DD1.136), connectors (XP14.2)
USB3-0-D_P: cm5 (DD1.134), connectors (XP14.3)
USB3-0-RX_N: cm5 (DD1.128), connectors (XP14.5)
USB3-0-RX_P: cm5 (DD1.130), connectors (XP14.6)
USB3-0-TX_N: cm5 (DD1.140), connectors (XP14.8)
USB3-0-TX_P: cm5 (DD1.142), connectors (XP14.9)
USB3-1-D_N: cm5 (DD1.165), connectors (XP15.2)
USB3-1-D_P: cm5 (DD1.163), connectors (XP15.3)
USB3-1-RX_N: cm5 (DD1.157), connectors (XP15.5)
USB3-1-RX_P: cm5 (DD1.159), connectors (XP15.6)
USB3-1-TX_N: cm5 (DD1.171), connectors (XP15.8)
USB3-1-TX_P: cm5 (DD1.169), connectors (XP15.9)

## Assembly variants
01: not fitted SB1 SB2 SB3